# Altium project Main Board Block v1.2 Project.PrjPcb
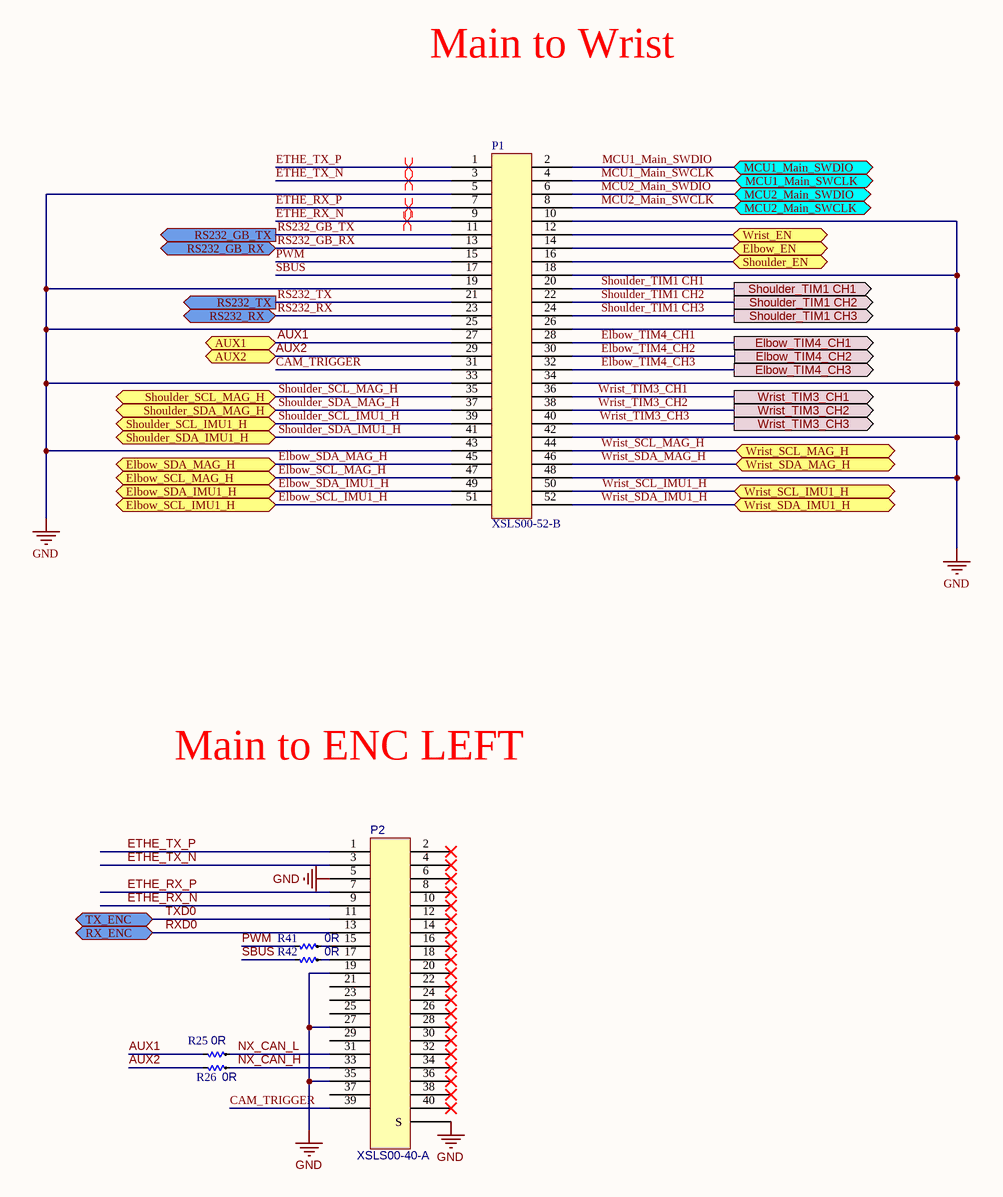
[diagram p0: Connector.SchDoc]
6 sheets, 158 parts. Net scope: flat (ports and power ports of the same name join across sheets).
Board file: Main_Block.PcbDoc
Sheets:
  Connector.SchDoc
  IMU.SchDoc
  PWR.SchDoc
  RS232.SchDoc
  MCU2.SchDoc
  MCU1.SchDoc

## Sheet Connector.SchDoc
size A3; SheetNumber: 1; SheetTotal: 6

### Parts
P1  XSLS00-52-B  [XSXL52]
P2  XSLS00-40-A  [XSXL40]
R25  value 0R  [RES0402]  (hidden comment: RES0402 0R)  (no BOM)
R26  value 0R  [RES0402]  (hidden comment: RES0402 0R)  (no BOM)
R41  value 0R  [RES0402]  (hidden comment: RES0402 0R)
R42  value 0R  [RES0402]  (hidden comment: RES0402 0R)

### Ports
AUX1 (bidir), AUX2 (bidir), Elbow_EN (bidir), Elbow_SCL_IMU1_H (bidir), Elbow_SCL_MAG_H (bidir), Elbow_SDA_IMU1_H (bidir), Elbow_SDA_MAG_H (bidir), Elbow_TIM4_CH1 (out), Elbow_TIM4_CH2 (out), Elbow_TIM4_CH3 (out), MCU1_Main_SWCLK (bidir), MCU1_Main_SWDIO (bidir), MCU2_Main_SWCLK (bidir), MCU2_Main_SWDIO (bidir), RS232_GB_RX (bidir), RS232_GB_TX (out), RS232_RX (bidir), RS232_TX (out), RX_ENC (bidir), Shoulder_EN (bidir), Shoulder_SCL_IMU1_H (bidir), Shoulder_SCL_MAG_H (bidir), Shoulder_SDA_IMU1_H (bidir), Shoulder_SDA_MAG_H (bidir), Shoulder_TIM1 CH1 (out), Shoulder_TIM1 CH2 (out), Shoulder_TIM1 CH3 (out), TX_ENC (bidir), Wrist_EN (bidir), Wrist_SCL_IMU1_H (bidir), Wrist_SCL_MAG_H (bidir), Wrist_SDA_IMU1_H (bidir), Wrist_SDA_MAG_H (bidir), Wrist_TIM3_CH1 (out), Wrist_TIM3_CH2 (out), Wrist_TIM3_CH3 (out)

### Nets
GND: P1.5 P1.10 P1.18 P1.19 P1.25 P1.26 P1.33 P1.34 P1.42 P1.43 P1.48 P2.0(S) P2.5 P2.19 P2.27 P2.35
AUX1: P1.27 R25.1 ; port AUX1
AUX2: P1.29 R26.1 ; port AUX2
CAM_TRIGGER: P1.31 P2.39
Elbow_SCL_IMU1_H: P1.51 ; port Elbow_SCL_IMU1_H
Elbow_SCL_MAG_H: P1.47 ; port Elbow_SCL_MAG_H
Elbow_SDA_IMU1_H: P1.49 ; port Elbow_SDA_IMU1_H
Elbow_SDA_MAG_H: P1.45 ; port Elbow_SDA_MAG_H
Elbow_TIM4_CH1: P1.28 ; port Elbow_TIM4_CH1
Elbow_TIM4_CH2: P1.30 ; port Elbow_TIM4_CH2
Elbow_TIM4_CH3: P1.32 ; port Elbow_TIM4_CH3
ETHE_RX_N: P1.9 P2.9
ETHE_RX_P: P1.7 P2.7
ETHE_TX_N: P1.3 P2.3
ETHE_TX_P: P1.1 P2.1
MCU1_Main_SWCLK: P1.4 ; port MCU1_Main_SWCLK
MCU1_Main_SWDIO: P1.2 ; port MCU1_Main_SWDIO
MCU2_Main_SWCLK: P1.8 ; port MCU2_Main_SWCLK
MCU2_Main_SWDIO: P1.6 ; port MCU2_Main_SWDIO
NX_CAN_H: P2.33 R26.2
NX_CAN_L: P2.31 R25.2
PWM: P1.15 R41.1
RS232_GB_RX: P1.13 ; port RS232_GB_RX
RS232_GB_TX: P1.11 ; port RS232_GB_TX
RS232_RX: P1.23 ; port RS232_RX
RS232_TX: P1.21 ; port RS232_TX
RXD0: P2.13 ; port RX_ENC
SBUS: P1.17 R42.1
Shoulder_SCL_IMU1_H: P1.39 ; port Shoulder_SCL_IMU1_H
Shoulder_SCL_MAG_H: P1.35 ; port Shoulder_SCL_MAG_H  [project net I2C1_SCL]
Shoulder_SDA_IMU1_H: P1.41 ; port Shoulder_SDA_IMU1_H
Shoulder_SDA_MAG_H: P1.37 ; port Shoulder_SDA_MAG_H  [project net I2C1_SDA]
Shoulder_TIM1 CH1: P1.20 ; port Shoulder_TIM1 CH1
Shoulder_TIM1 CH2: P1.22 ; port Shoulder_TIM1 CH2
Shoulder_TIM1 CH3: P1.24 ; port Shoulder_TIM1 CH3
TXD0: P2.11 ; port TX_ENC
Wrist_SCL_IMU1_H: P1.50 ; port Wrist_SCL_IMU1_H  [project net I2C3_SCL]
Wrist_SCL_MAG_H: P1.44 ; port Wrist_SCL_MAG_H
Wrist_SDA_IMU1_H: P1.52 ; port Wrist_SDA_IMU1_H  [project net I2C3_SDA]
Wrist_SDA_MAG_H: P1.46 ; port Wrist_SDA_MAG_H
Wrist_TIM3_CH1: P1.36 ; port Wrist_TIM3_CH1
Wrist_TIM3_CH2: P1.38 ; port Wrist_TIM3_CH2
Wrist_TIM3_CH3: P1.40 ; port Wrist_TIM3_CH3
NetP1_12: P1.12 ; port Wrist_EN
NetP1_14: P1.14 ; port Elbow_EN
NetP1_16: P1.16 ; port Shoulder_EN
NetP2_15: P2.15 R41.2
NetP2_17: P2.17 R42.2

Not connected (* = marked no-connect by the designer): P2 2* 4* 6* 8* 10* 12* 14* 16* 18* 20* 21 22* 23 24* 25 26* 28* 29 30* 32* 34* 36* 37 38* 40*

### Layout directives
differential pair: ETHE_RX_N, ETHE_RX_P, ETHE_TX_N, ETHE_TX_P

### Notes on the sheet
- Main to Wrist
- Main to ENC LEFT

### Library data of the parts
R25 R26 R41 R42 = RES0402 0R: RES 0R 0402; MP: RC0402JR-070RL; Power Rating: 63mW; Tolerance: 5%; Package: 0402
P2 = XSLS00-40-A: Manufacturer Part Number 1: XSLS00-40-A

## Sheet IMU.SchDoc
size A; SheetNumber: 2; SheetTotal: 6
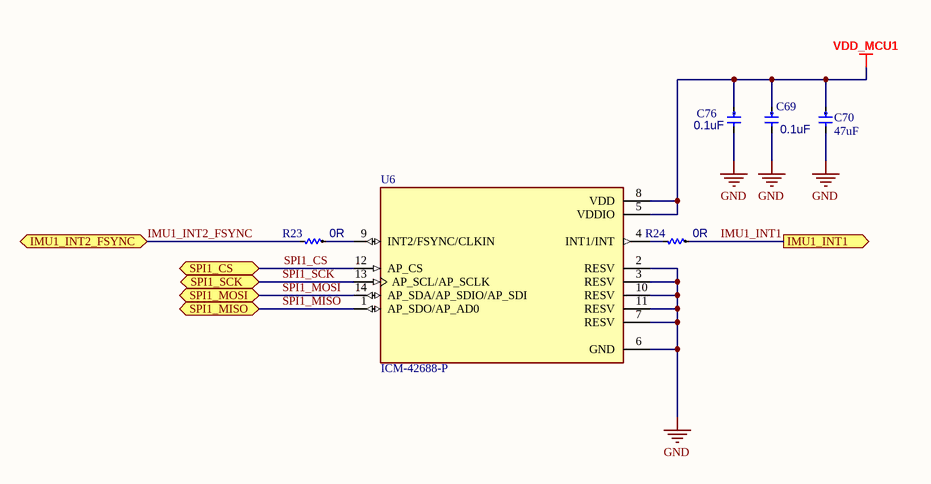
[diagram p1: IMU.SchDoc]

### Parts
C69  value 0.1uF  [CAP0402]  (hidden comment: CAP0402 0.1uF 50V)
C70  Capacitance: 47uF  [CAP0805]  (hidden comment: CL21A476MQYNNNE)
C76  value 0.1uF  [CAP0402]  (hidden comment: CAP0402 0.1uF 50V)
R23  value 0R  [RES0402]  (hidden comment: RES0402 0R)
R24  value 0R  [RES0402]  (hidden comment: RES0402 0R)
U6  ICM-42688-P  [IMU42688]

### Ports
IMU1_INT1 (out), IMU1_INT2_FSYNC (bidir), SPI1_CS (bidir), SPI1_MISO (bidir), SPI1_MOSI (bidir), SPI1_SCK (bidir)

### Nets
GND: C69.2 C70.2 C76.2 U6.2(RESV) U6.3(RESV) U6.6(GND) U6.7(RESV) U6.10(RESV) U6.11(RESV)
VDD_MCU1: C69.1 C70.1 C76.1 U6.5(VDDIO) U6.8(VDD)
IMU1_INT1: R24.2 ; port IMU1_INT1
IMU1_INT2_FSYNC: R23.1 ; port IMU1_INT2_FSYNC
SPI1_CS: U6.12(AP_CS) ; port SPI1_CS
SPI1_MISO: U6.1(AP_SDO/AP_AD0) ; port SPI1_MISO
SPI1_MOSI: U6.14(AP_SDA/AP_SDIO/AP_SDI) ; port SPI1_MOSI
SPI1_SCK: U6.13(AP_SCL/AP_SCLK) ; port SPI1_SCK
NetR23_2: R23.2 U6.9(INT2/FSYNC/CLKIN)
NetR24_1: R24.1 U6.4(INT1/INT)

### Library data of the parts
C69 C76 = CAP0402 0.1uF 50V: Cap 0.1uF 50V 0402; MP: CC0402KRX5R9BB104; Tolerance: 10%; Voltage: 50V; Package: 0402
C70 = 885012107014: CAP CER 47UF 6.3V X5R 0805; Tolerance: 20%; Manufacturer Part Number: CL21A476MQYNNNE; RoHS: Yes; Category: Ceramic Capacitors; Stock 1: 3580; Pricing 1: 1=0.37000, 5=0.35200, 10=0.33000, 25=0.31900, 50=0.30900, 100=0.29800 (USD); Mount: Surface Mount; Case/Package: 0805; Case Code (Metric): 2012; Case Code (Imperial): 0805; Min Operating Temperature: -55°C; Max Operating Temperature: 85°C; Packaging: Cut Tape; Voltage Rating: 6.3V; Dielectric: X5R; Voltage Rating (DC): 6.3V; Series: WCAP-CSGP; Length: 0.079inch; Width: 0.049inch; Thickness: 0.057inch; RoHS Compliant: Yes; ComponentLink1URL: http://www.farnell.com/datasheets/1958454.pdf?src-supplier=Farnell; ComponentLink1Description: http://www.farnell.com/datasheets/1958454.pdf?src-supplier=Farnell; ComponentLink2URL: http://www.farnell.com/datasheets/1958454.pdf?src-supplier=Element14; ComponentLink2Description: http://www.farnell.com/datasheets/1958454.pdf?src-supplier=Element14; ComponentLink3URL: https://katalog.we-online.de/pbs/datasheet/885012107014.pdf?src-supplier=Digi-Key; ComponentLink3Description: https://katalog.we-online.de/pbs/datasheet/885012107014.pdf?src-supplier=Digi-Key; ComponentLink4URL: http://www.farnell.com/datasheets/1958454.pdf?src-supplier=Newark; ComponentLink4Description: http://www.farnell.com/datasheets/1958454.pdf?src-supplier=Newark; Supplier 1: Newark
R23 R24 = RES0402 0R: as R25 on sheet Connector; Package: 0402
U6 = ICM-42688-P: Accelerometer, Gyroscope, 6 Axis Sensor Output; Package: None; MP: ICM-42688-P; Value: *; Availability: Unavailable; Price: None

## Sheet PWR.SchDoc
size A3; SheetNumber: 3; SheetTotal: 6
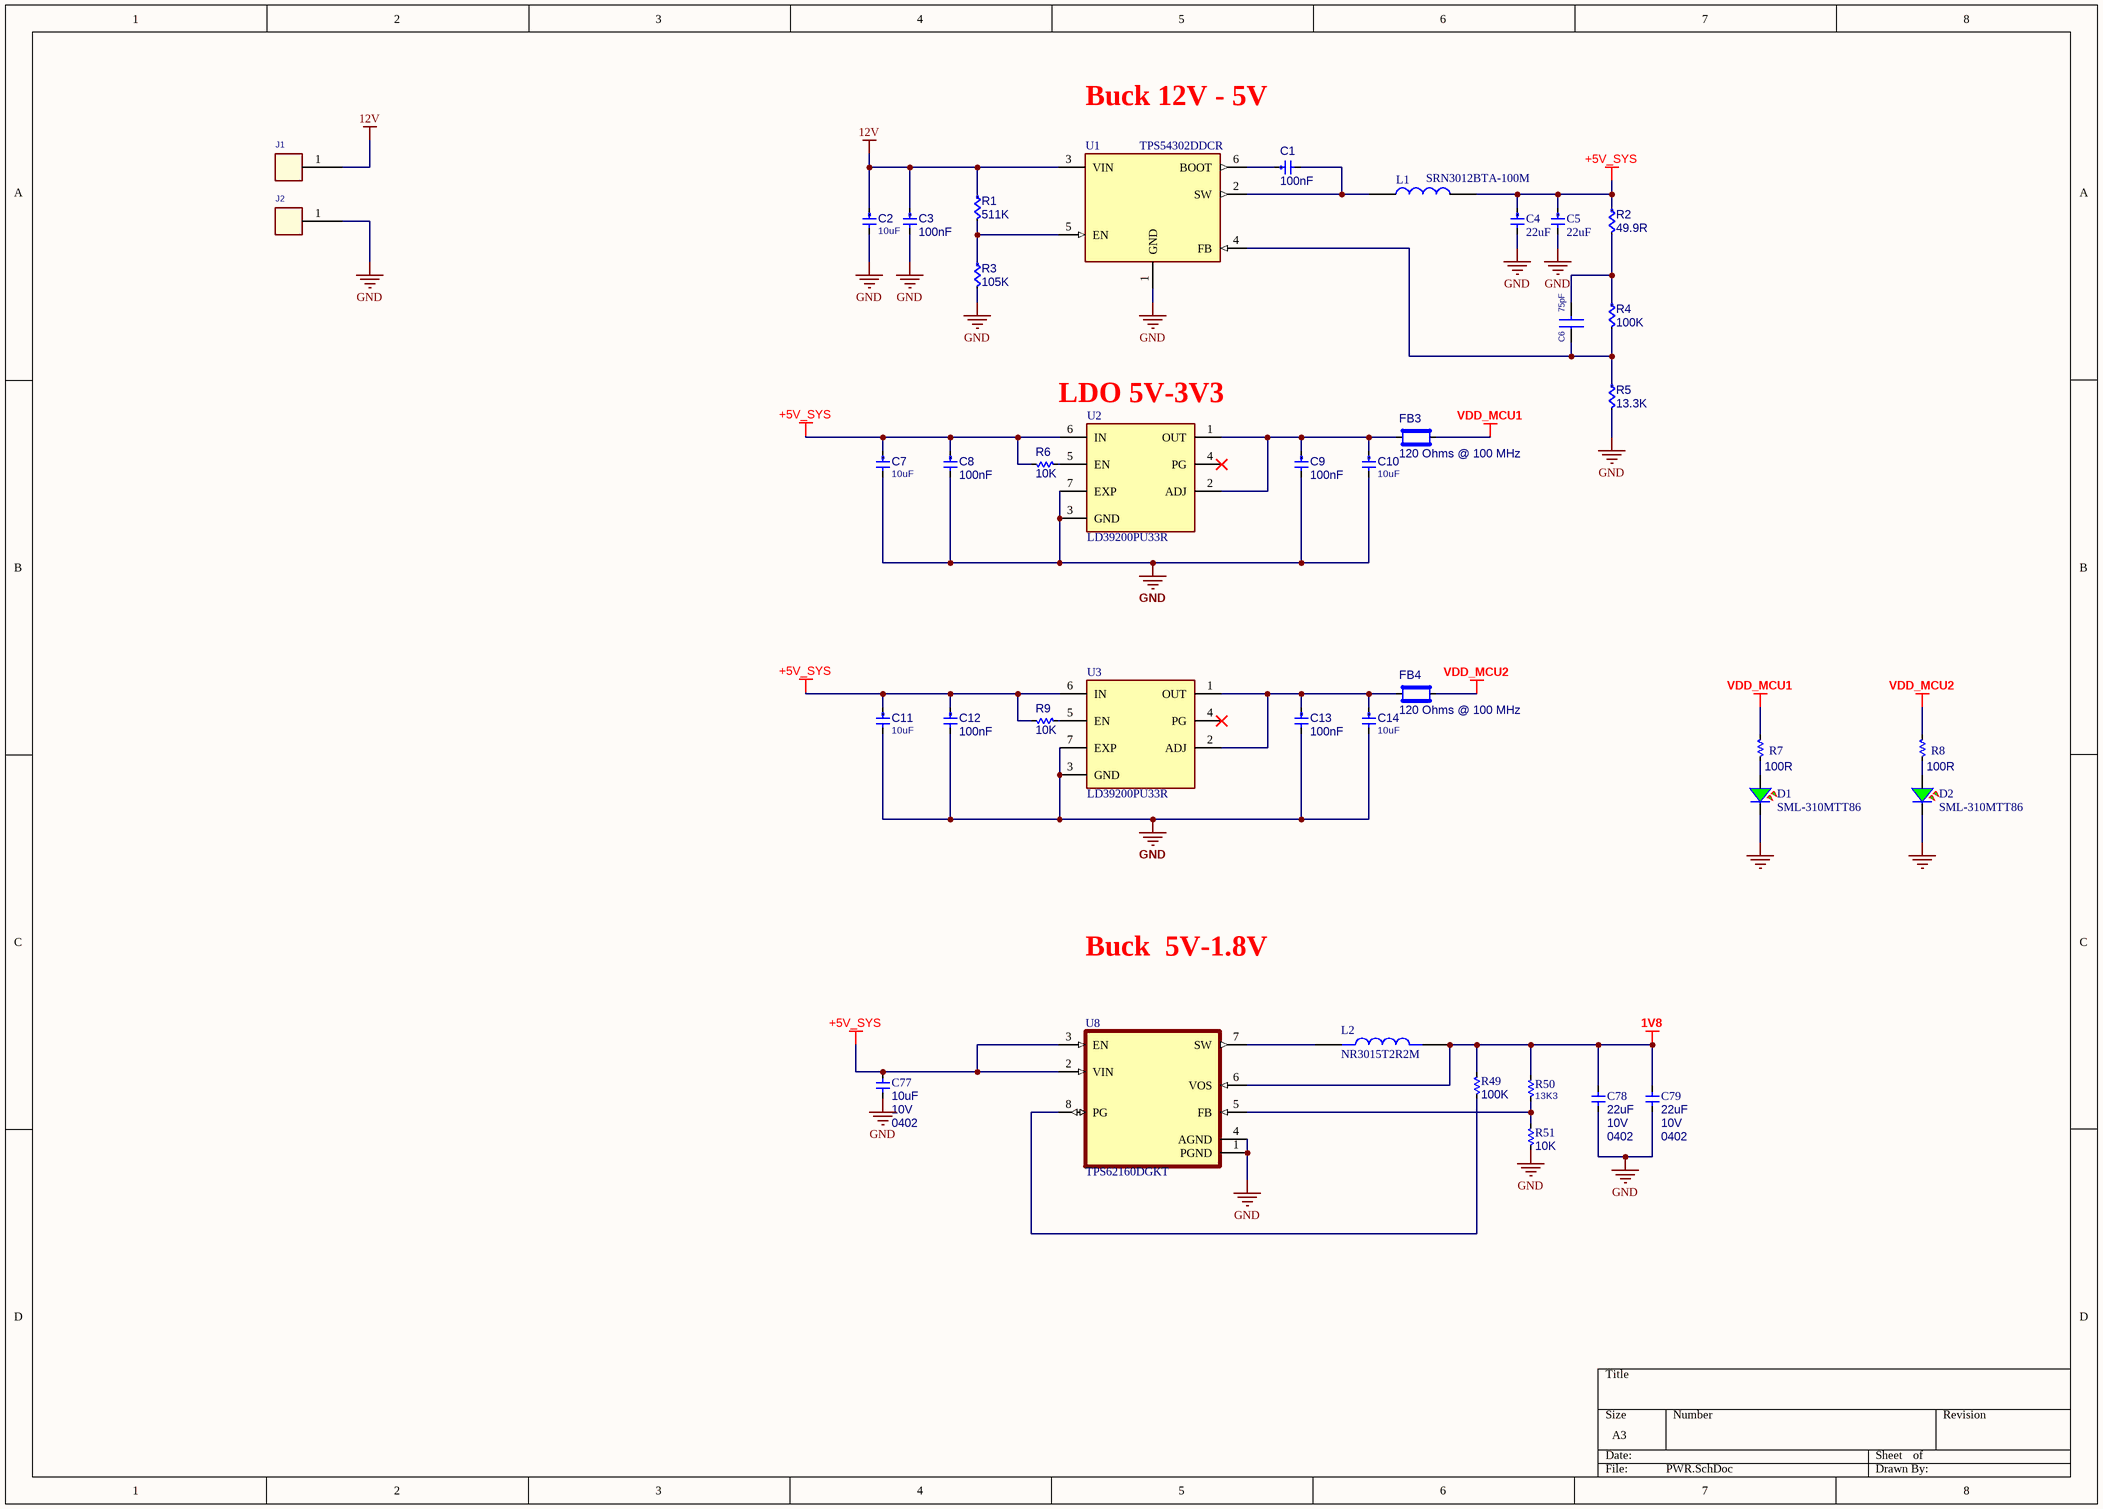
[diagram p2: PWR.SchDoc]

### Parts
C1  Capacitance: 100nF  [CAP0402]  (hidden comment: CC0402KRX5R9BB104)
C2  Capacitance: 10uF  [CAP0603-M]  (hidden comment: GRM188R6YA106MA73D)
C3  Capacitance: 100nF  [CAP0402]  (hidden comment: CC0402KRX5R9BB104)
C4  Capacitance: 22uF  [CAP0402]  (hidden comment: GRM158R61A226ME15D)
C5  Capacitance: 22uF  [CAP0402]  (hidden comment: GRM158R61A226ME15D)
C6  75pF  [CAP0402]
C7  Capacitance: 10uF  [CAP0603]  (hidden comment: GRM188R6YA106MA73D)
C8  Capacitance: 100nF  [CAP0402]  (hidden comment: CC0402KRX5R9BB104)
C9  Capacitance: 100nF  [CAP0402]  (hidden comment: CC0402KRX5R9BB104)
C10  Capacitance: 10uF  [CAP0603]  (hidden comment: GRM188R6YA106MA73D)
C11  Capacitance: 10uF  [CAP0603]  (hidden comment: GRM188R6YA106MA73D)
C12  Capacitance: 100nF  [CAP0402]  (hidden comment: CC0402KRX5R9BB104)
C13  Capacitance: 100nF  [CAP0402]  (hidden comment: CC0402KRX5R9BB104)
C14  Capacitance: 10uF  [CAP0603]  (hidden comment: GRM188R6YA106MA73D)
C77  value 10uF  Voltage: 10V  Package: 0402  [CAP0402]  (hidden comment: CAP0402 10uF 10V)
C78  value 22uF  Voltage: 10V  Package: 0402  [CAP0402]  (hidden comment: CAP0402 22uF 10V)
C79  value 22uF  Voltage: 10V  Package: 0402  [CAP0402]  (hidden comment: CAP0402 22uF 10V)
D1  SML-310MTT86  [LED0603 GREEN]
D2  SML-310MTT86  [LED0603 GREEN]
FB3  Impedance @ Frequency: 120 Ohms @ 100 MHz  [FERRIT0402]  (hidden comment: BLM15PX121SZ1D)
FB4  Impedance @ Frequency: 120 Ohms @ 100 MHz  [FERRIT0402]  (hidden comment: BLM15PX121SZ1D)
J1  CON1  [wire1_220s]  (value not drawn)
J2  CON1  [wire1_220s]  (value not drawn)
L1  SRN3012BTA-100M  [SRN3012BTA-100M]
L2  NR3015T2R2M  [IND_NR3015T2R2M]
R1  511K  [RES0402]
R2  49.9R  [RES0402]
R3  105K  [RES0402]
R4  100K  [RES0402]
R5  13.3K  [RES0402]
R6  value 10K  [RES0402]  (hidden comment: RES0402 10K)
R7  value 100R  [RES0402]  (hidden comment: RES0402 100R)
R8  value 100R  [RES0402]  (hidden comment: RES0402 100R)
R9  value 10K  [RES0402]  (hidden comment: RES0402 10K)
R49  value 100K  [RES0402]  (hidden comment: RES0402 100K)
R50  value 13K3  [RES0402]  (hidden comment: RES0402 13K3)
R51  value 10K  [RES0402]  (hidden comment: RES0402 10K)
U1  TPS54302DDCR  [SOT95P280X110-6N - duplicate1]
U2  LD39200PU33R  [LD39200PUR]
U3  LD39200PU33R  [LD39200PUR]
U8  TPS62160DGKT  [SOP65P490X110-8N]

### Nets
1V8: C78.2 C79.2 L2.2 R49.2 R50.2 U8.6(VOS)
12V: C2.1 C3.1 J1.1 R1.1 U1.3(VIN)
+5V_SYS: C4.1 C5.1 C7.1 C8.1 C11.1 C12.1 C77.2 L1.2 R2.1 R6.2 R9.2 U2.6(IN) U3.6(IN) U8.2(VIN) U8.3(EN)
GND: C2.2 C3.2 C4.2 C5.2 C7.2 C8.2 C9.2 C10.2 C11.2 C12.2 C13.2 C14.2 C77.1 C78.1 C79.1 D1.1 D2.1 J2.1 R3.2 R5.2 R51.1 U1.1(GND) U2.3(GND) U2.7(EXP) U3.3(GND) U3.7(EXP) U8.1(PGND) U8.4(AGND)
VDD_MCU1: FB3.2 R7.2
VDD_MCU2: FB4.2 R8.2
NetC1_1: C1.1 U1.6(BOOT)
NetC1_2: C1.2 L1.1 U1.2(SW)
NetC6_1: C6.1 R4.2 R5.1 U1.4(FB)
NetC6_2: C6.2 R2.2 R4.1
NetC9_1: C9.1 C10.1 FB3.1 U2.1(OUT) U2.2(ADJ)
NetC13_1: C13.1 C14.1 FB4.1 U3.1(OUT) U3.2(ADJ)
NetD1_2: D1.2 R7.1
NetD2_2: D2.2 R8.1
NetL2_1: L2.1 U8.7(SW)
NetR1_2: R1.2 R3.1 U1.5(EN)
NetR6_1: R6.1 U2.5(EN)
NetR9_1: R9.1 U3.5(EN)
NetR49_1: R49.1 U8.8(PG)
NetR50_1: R50.1 R51.2 U8.5(FB)

Not connected (* = marked no-connect by the designer): U2 4(PG)*; U3 4(PG)*

### Notes on the sheet
- Buck 12V - 5V
- (near U2) LDO 5V-3V3
- Buck  5V-1.8V

### Library data of the parts
C1 C3 C8 C9 C12 C13 = CMP-00265-1: CAP CER 0.1UF 50V X5R 0402; Manufacturer: Yageo; Tolerance: 10%; Voltage Rating: 50V; Dielectric: X5R; Width: 0.02inch; Thickness: 0.022inch; Packaging: Tape and Reel; Length: 0.039inch; Mount: Surface Mount; Case/Package: 0402; Min Operating Temperature: -55°C; Halogen Free: Halogen Free; Voltage Rating (DC): 50V; Manufacturer Part Number: CC0402KRX5R9BB104; Max Operating Temperature: 85°C; Lead Free: Lead Free; Manufacturer 1: Yageo; Manufacturer Part Number 1: CC0402KRX5R9BB104
C2 C7 C10 C11 C14 = CMP-01031-1: CAP CER 10UF 35V X5R 0603; Manufacturer 1: Murata Electronics; Tolerance: 20%; Case/Package: 0603; Depth: 0.8mm; Composition: Ceramic; Length: 1.6mm; Max Operating Temperature: 85°C; Lead Free: Lead Free; Thickness: 0.031inch; Number of Pins: 2; Weight: 0.000222oz; Min Operating Temperature: -55°C; REACH SVHC: No SVHC; Case Code (Metric): 1608; Termination: SMD/SMT; Packaging: Tape and Reel; Height: 0.8mm; Voltage Rating (DC): 35V; Width: 0.031inch; Voltage Rating: 35V; Manufacturer Part Number 1: GRM188R6YA106MA73D; Mount: Surface Mount; Package Quantity: 1; Case Code (Imperial): 0603; Dielectric: X5R; Voltage: 35V
C4 C5 = CMP-00520-1: CAP CER 22UF 10V X5R 0402; Manufacturer 1: TDK Corporation; Tolerance: 10%; Case Code (Imperial): 0402; Case/Package: 0402; Voltage: 10V; Min Operating Temperature: -55°C; Termination: SMD/SMT; Voltage Rating: 10V; Length: 1mm; REACH SVHC: No SVHC; Max Operating Temperature: 85°C; Radiation Hardening: No; Depth: 0.5mm; Case Code (Metric): 1005; Dielectric: X5R; Manufacturer Part Number 1: GRM158R61A226ME15D; Packaging: Tape and Reel
C6 = CAP_Dup1_16: CAP CER 75PF 25V C0G/NP0 0402; Manufacturer PN: CC0402JRNPO9BN750; Manufacturer: YAGEO; PART_NUMBER: TMP-416; CLASS: DISCRETE; Tolerance: 5%; Temperature Coefficient: C0G, NP0; Dielectric Type: Capacitors; Rated Voltage: 25V; Package Size: 0402 (1005 Metric)
C77 = CAP0402 10uF 10V: Cap 10uF 10V 0402; MP: GRT155R61A106ME13D
C78 C79 = CAP0402 22uF 10V: Cap 22uF 10V 0402; MP: GRM158R61A226ME15D
D1 D2 = CMP-01130-2: LED GREEN CLEAR 0603 SMD; Manufacturer 1: Rohm Semiconductor; Luminous Intensity: 16mcd; Wavelength: 570nm; Number of LEDs: 1; Color: Green,Yellow; Forward Voltage: 2.2V; Lens Color: Colorless,Clear; Forward Current: 20mA; Viewing Angle: 140°; Lens Style: Rectangular,Clear,Diffused,Colorless; Case Code (Imperial): 0603; Lens Transparency: Clear; Package Quantity: 3000; Width: 0.8mm; Manufacturer Part Number 1: SML-310MTT86; Min Operating Temperature: -30°C; Length: 1.6mm; Packaging: Tape and Reel; Dominant Wavelength: 570nm; Height: 0.9mm; Radiation Hardening: No; Test Current: 20mA; Case Code (Metric): 1608; Lead Free: Lead Free; Case/Package: 0603; Mount: Surface Mount; Max Operating Temperature: 85°C; Illumination Color: Green; Number of Pins: 2
FB3 FB4 = BLM15PX121SZ1D: 120 Ohms @ 100 MHz 1 Power Line Ferrite Bead 0402 (1005 Metric) 2A 55mOhm; MP: BLM15PX121SZ1D; Current Rating (Max): 2A; DC Resistance (DCR) (Max): 55mOhm
J1 J2 = CON1: SOLDER PADS
L1 = SRN3012BTA-330M: 10uH; Manufacturer_Name: Bourns; Geometry.Height: 1.2mm; Mouser Part Number: SRN3012BTA-100M; Mouser Price/Stock: https://www.mouser.co.uk/ProductDetail/Bourns/SRN3012BTA-330M?qs=Imq1NPwxi74rPoSZ4PPaRw%3D%3D; Manufacturer_Part_Number: SRN3012BTA-100M; Datasheet Link: https://www.bourns.com/docs/Product-Datasheets/SRN3012BTA.pdf
L2 = NR3015T2R2M: 2.2 ÂµH Shielded Drum Core, Wirewound Inductor 1.5 A 72mOhm Max Nonstandard; MF: Taiyo Yuden; MP: NR3015T2R2M; Price: None; Purchase-URL: https://pricing.snapeda.com/search/part/NR3015T2R2M/?ref=eda; Package: Nonstandard Taiyo Yuden; Check_prices: https://www.snapeda.com/parts/NR3015T2R2M/Taiyo+Yuden/view-part/?ref=eda; Value: *; Availability: In Stock; SnapEDA_Link: https://www.snapeda.com/parts/NR3015T2R2M/Taiyo+Yuden/view-part/?ref=snap
R1 = CMP-00299-1_1: RES SMD 511K OHM 1% 1/16W 0402; Manufacturer: Yageo; Manufacturer Part Number: RC0402FR-07511KL; Temperature Coefficient: 100ppm/°C; Working Voltage: 50V; Max Power Dissipation: 63mW; Power Rating: 62.5mW; Height: 0.016inch; Package Quantity: 1; Min Operating Temperature: -55°C; Tolerance: 1%; Military Standard: Not; Packaging: Tape and Reel; Number of Terminations: 2; Width: 0.02inch; Case/Package: 0402; Length: 1mm; Voltage Rating (DC): 50V; Case Code (Metric): 1005; Resistance: 511K; Composition: Thick Film; Voltage Rating: 50V; Max Operating Temperature: 155°C; Case Code (Imperial): 0402; Lead Free: Lead Free; Termination: SMD/SMT; Features: Moisture Resistant; Depth: 0.5mm; Manufacturer 1: Yageo; Manufacturer Part Number 1: RC0402FR-07511KL
R2 = CMP-00299-1_1: RES SMD 49.9R OHM 1% 1/16W 0402; Manufacturer: Yageo; Manufacturer Part Number: RC0402FR-0749R9L; Temperature Coefficient: 100ppm/°C; Working Voltage: 50V; Max Power Dissipation: 63mW; Power Rating: 62.5mW; Height: 0.016inch; Package Quantity: 1; Min Operating Temperature: -55°C; Tolerance: 1%; Military Standard: Not; Packaging: Tape and Reel; Number of Terminations: 2; Width: 0.02inch; Case/Package: 0402; Length: 1mm; Voltage Rating (DC): 50V; Case Code (Metric): 1005; Resistance: 49.9R; Composition: Thick Film; Voltage Rating: 50V; Max Operating Temperature: 155°C; Case Code (Imperial): 0402; Lead Free: Lead Free; Termination: SMD/SMT; Features: Moisture Resistant; Depth: 0.5mm; Manufacturer 1: Yageo; Manufacturer Part Number 1: RC0402FR-0749R9L
R3 = CMP-00299-1_1: RES SMD 105K OHM 1% 1/16W 0402; Manufacturer: Yageo; Manufacturer Part Number: RC0402FR-07105KL; Temperature Coefficient: 100ppm/°C; Working Voltage: 50V; Max Power Dissipation: 63mW; Power Rating: 62.5mW; Height: 0.016inch; Package Quantity: 1; Min Operating Temperature: -55°C; Tolerance: 1%; Military Standard: Not; Packaging: Tape and Reel; Number of Terminations: 2; Width: 0.02inch; Case/Package: 0402; Length: 1mm; Voltage Rating (DC): 50V; Case Code (Metric): 1005; Resistance: 105K; Composition: Thick Film; Voltage Rating: 50V; Max Operating Temperature: 155°C; Case Code (Imperial): 0402; Lead Free: Lead Free; Termination: SMD/SMT; Features: Moisture Resistant; Depth: 0.5mm; Manufacturer 1: Yageo; Manufacturer Part Number 1: RC0402FR-07105KL
R4 = CMP-00299-1_1: RES SMD 100K OHM 1% 1/16W 0402; Manufacturer: Yageo; Manufacturer Part Number: RC0402FR-07100KL; Temperature Coefficient: 100ppm/°C; Working Voltage: 50V; Max Power Dissipation: 63mW; Power Rating: 62.5mW; Height: 0.016inch; Package Quantity: 1; Min Operating Temperature: -55°C; Tolerance: 1%; Military Standard: Not; Packaging: Tape and Reel; Number of Terminations: 2; Width: 0.02inch; Case/Package: 0402; Length: 1mm; Voltage Rating (DC): 50V; Case Code (Metric): 1005; Resistance: 100K; Composition: Thick Film; Voltage Rating: 50V; Max Operating Temperature: 155°C; Case Code (Imperial): 0402; Lead Free: Lead Free; Termination: SMD/SMT; Features: Moisture Resistant; Depth: 0.5mm; Manufacturer 1: Yageo; Manufacturer Part Number 1: RC0402FR-07100KL
R5 = CMP-00299-1_1: RES SMD 13.3K OHM 1% 1/16W 0402; Manufacturer: Yageo; Manufacturer Part Number: RC0402FR-0713K3L; Temperature Coefficient: 100ppm/°C; Working Voltage: 50V; Max Power Dissipation: 63mW; Power Rating: 62.5mW; Height: 0.016inch; Package Quantity: 1; Min Operating Temperature: -55°C; Tolerance: 1%; Military Standard: Not; Packaging: Tape and Reel; Number of Terminations: 2; Width: 0.02inch; Case/Package: 0402; Length: 1mm; Voltage Rating (DC): 50V; Case Code (Metric): 1005; Resistance: 13.3K; Composition: Thick Film; Voltage Rating: 50V; Max Operating Temperature: 155°C; Case Code (Imperial): 0402; Lead Free: Lead Free; Termination: SMD/SMT; Features: Moisture Resistant; Depth: 0.5mm; Manufacturer 1: Yageo; Manufacturer Part Number 1: RC0402FR-0713K3L
R6 R9 R51 = RES0402 10K: RES 10K 0402; MP: RC0402FR-0710KL
R7 R8 = RES0402 100R: RES 100R 0402; MP: RC0402FR-07100RL
R49 = RES0402 100K: RES 100K 0402; MP: RC0402FR-07100KL
R50 = RES0402 13K3: RES 13K3 0402; MP: RC0402FR-0713K3L
U1 = TPS54302DDCR: 4.5-V to 28-V Input, 3-A Output, EMI Friendly Synchronous Step-Down Converter; MF: Texas Instruments; Package: SOT-23-THN-6 Texas Instruments; Price: None; Check_prices: https://www.snapeda.com/parts/TPS54302DDCR/Texas+Instruments/view-part/?ref=eda; Value: *; SnapEDA_Link: https://www.snapeda.com/parts/TPS54302DDCR/Texas+Instruments/view-part/?ref=snap; MP: TPS54302DDCR; Availability: In Stock; Purchase-URL: https://pricing.snapeda.com/search?q=TPS54302DDCR&ref=eda
U2 U3 = LD39200PUR: LDO IC 1 Output 2A 6-DFN _3x3_; MF: STMicroelectronics; Package: DFN-6 STMicroelectronics; Availability: Unavailable; MP: LD39200PU33R; Value: *; SnapEDA_Link: https://www.snapeda.com/parts/LD39200PUR/STMicroelectronics/view-part/882017/?ref=snap; Price: None
U8 = TPS62160DGKT: 3V-17V 1A Step-Down Converters with DCS-Controlâ„¢; MF: Texas Instruments; SnapEDA_Link: https://www.snapeda.com/parts/TPS62160DGKT/Texas+Instruments/view-part/?ref=snap; Package: VSSOP-8 Texas Instruments; Value: *; MP: TPS62160DGKT; Check_prices: https://www.snapeda.com/parts/TPS62160DGKT/Texas+Instruments/view-part/?ref=eda

## Sheet RS232.SchDoc
size A; SheetNumber: 4; SheetTotal: 6
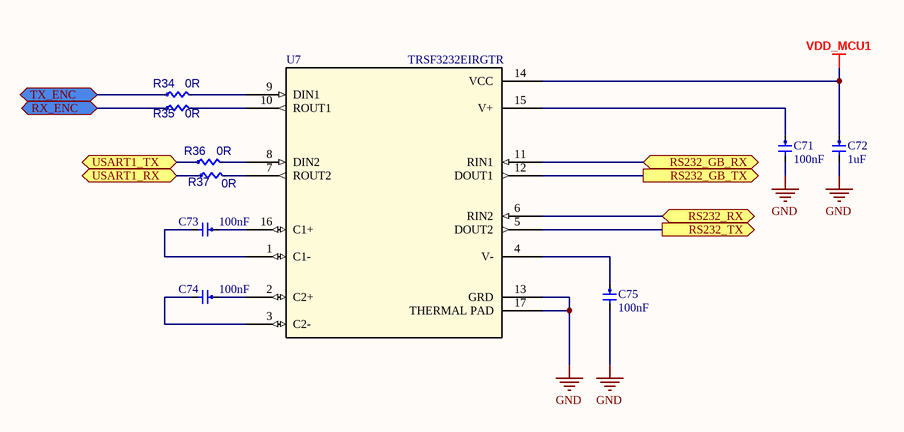
[diagram p3: RS232.SchDoc]

### Parts
C71  Capacitance: 100nF  [CAP0402]  (hidden comment: GRM155R71H104KE14D)
C72  Capacitance: 1uF  [CAP0402]  (hidden comment: CC0402KRX5R8BB105)
C73  Capacitance: 100nF  [CAP0402]  (hidden comment: GRM155R71H104KE14D)
C74  Capacitance: 100nF  [CAP0402]  (hidden comment: GRM155R71H104KE14D)
C75  Capacitance: 100nF  [CAP0402]  (hidden comment: GRM155R71H104KE14D)
R34  Resistance: 0R  [RES0402]  (hidden comment: ERJ-2RKF4701X)
R35  Resistance: 0R  [RES0402]  (hidden comment: ERJ-2RKF4701X)
R36  Resistance: 0R  [RES0402]  (hidden comment: ERJ-2RKF4701X)
R37  Resistance: 0R  [RES0402]  (hidden comment: ERJ-2RKF4701X)
U7  TRSF3232EIRGTR  [TRSF3232EIRGTR]

### Ports
RS232_GB_RX (bidir), RS232_GB_TX (out), RS232_RX (bidir), RS232_TX (out), RX_ENC (bidir), TX_ENC (bidir), USART1_RX (bidir), USART1_TX (bidir)

### Nets
GND: C71.2 C72.2 C75.2 U7.13(GRD) U7.17(THERMAL_PAD)
VDD_MCU1: C72.1 U7.14(VCC)
RS232_GB_RX: U7.11(RIN1) ; port RS232_GB_RX
RS232_GB_TX: U7.12(DOUT1) ; port RS232_GB_TX
RS232_RX: U7.6(RIN2) ; port RS232_RX
RS232_TX: U7.5(DOUT2) ; port RS232_TX
RXD0: R35.1 ; port RX_ENC
TXD0: R34.1 ; port TX_ENC
USART1_RX: R37.1 ; port USART1_RX
USART1_TX: R36.1 ; port USART1_TX
NetC71_1: C71.1 U7.15(V+)
NetC73_1: C73.1 U7.16(C1+)
NetC73_2: C73.2 U7.1(C1-)
NetC74_1: C74.1 U7.2(C2+)
NetC74_2: C74.2 U7.3(C2-)
NetC75_1: C75.1 U7.4(V-)
NetR34_2: R34.2 U7.9(DIN1)
NetR35_2: R35.2 U7.10(ROUT1)
NetR36_2: R36.2 U7.8(DIN2)
NetR37_2: R37.2 U7.7(ROUT2)

### Library data of the parts
C71 C73-C75 = CMP-01036-1: CAP CER 0.1UF 50V X7R 0402; Manufacturer 1: Murata Electronics; Dielectric Material: Ceramic; Tolerance: 10%; Dissipation Factor: 0.025%; Termination: SMD/SMT; Voltage Rating: 50V; Composition: Ceramic; Max Operating Temperature: 125°C; REACH SVHC: No SVHC; Case/Package: 0402; Case Code (Imperial): 0402; Material: Ceramic; Manufacturer Part Number 1: GRM155R71H104KE14D; Weight: 0.000212oz; Width: 0.5mm; Package Quantity: 10000; Packaging: Tape and Reel; Mount: Surface Mount; Voltage Rating (DC): 50V; Dielectric: X7R; Depth: 0.5mm; Case Code (Metric): 1005; Length: 1mm; Height: 0.5mm; Min Operating Temperature: -55°C; Thickness: 0.022inch; Lead Free: Lead Free; Voltage: 50V
C72 = CMP-00520-1: CAP CER 1UF 25V X5R 0402; Manufacturer 1: TDK Corporation; Tolerance: 10%; Case Code (Imperial): 0402; Case/Package: 0402; Voltage: 25V; Min Operating Temperature: -55°C; Termination: SMD/SMT; Voltage Rating: 25V; Length: 1mm; REACH SVHC: No SVHC; Max Operating Temperature: 85°C; Radiation Hardening: No; Depth: 0.5mm; Case Code (Metric): 1005; Dielectric: X5R; Manufacturer Part Number 1: CC0402KRX5R8BB105; Packaging: Tape and Reel
R34-R37 = CMP-00607-1: RES SMD 4.7K OHM 1% 1/10W 0402; Manufacturer 1: Panasonic Electronic Components; Voltage Rating (DC): 50V; Power Rating: 100mW; Temperature Coefficient: 100ppm/°C; Depth: 0.5mm; Packaging: Tape and Reel; Width: 0.02inch; Case/Package: 0402; Tolerance: 1%; Composition: Thick Film; Case Code (Metric): 1005; Military Standard: Not; Voltage Rating: 50V; Manufacturer Part Number 1: ERJ-2RKF4701X; Number of Pins: 2; Package Quantity: 1; Case Code (Imperial): 0402; Lead Free: Lead Free; Height: 0.35mm; Radiation Hardening: No; Mount: Surface Mount; REACH SVHC: No SVHC; Number of Terminations: 2; Features: Automotive AEC-Q200; Length: 1mm; Min Operating Temperature: -55°C; Max Operating Temperature: 155°C; Max Power Dissipation: 100mW; Contact Plating: Tin; Termination: SMD/SMT
U7 = TRSF3232EIRGTR: No Description Available; Mfr_Name: Texas Instruments; RefDes: RefDes; Type: Type

## Sheet MCU2.SchDoc
size A3; SheetNumber: 5; SheetTotal: 6
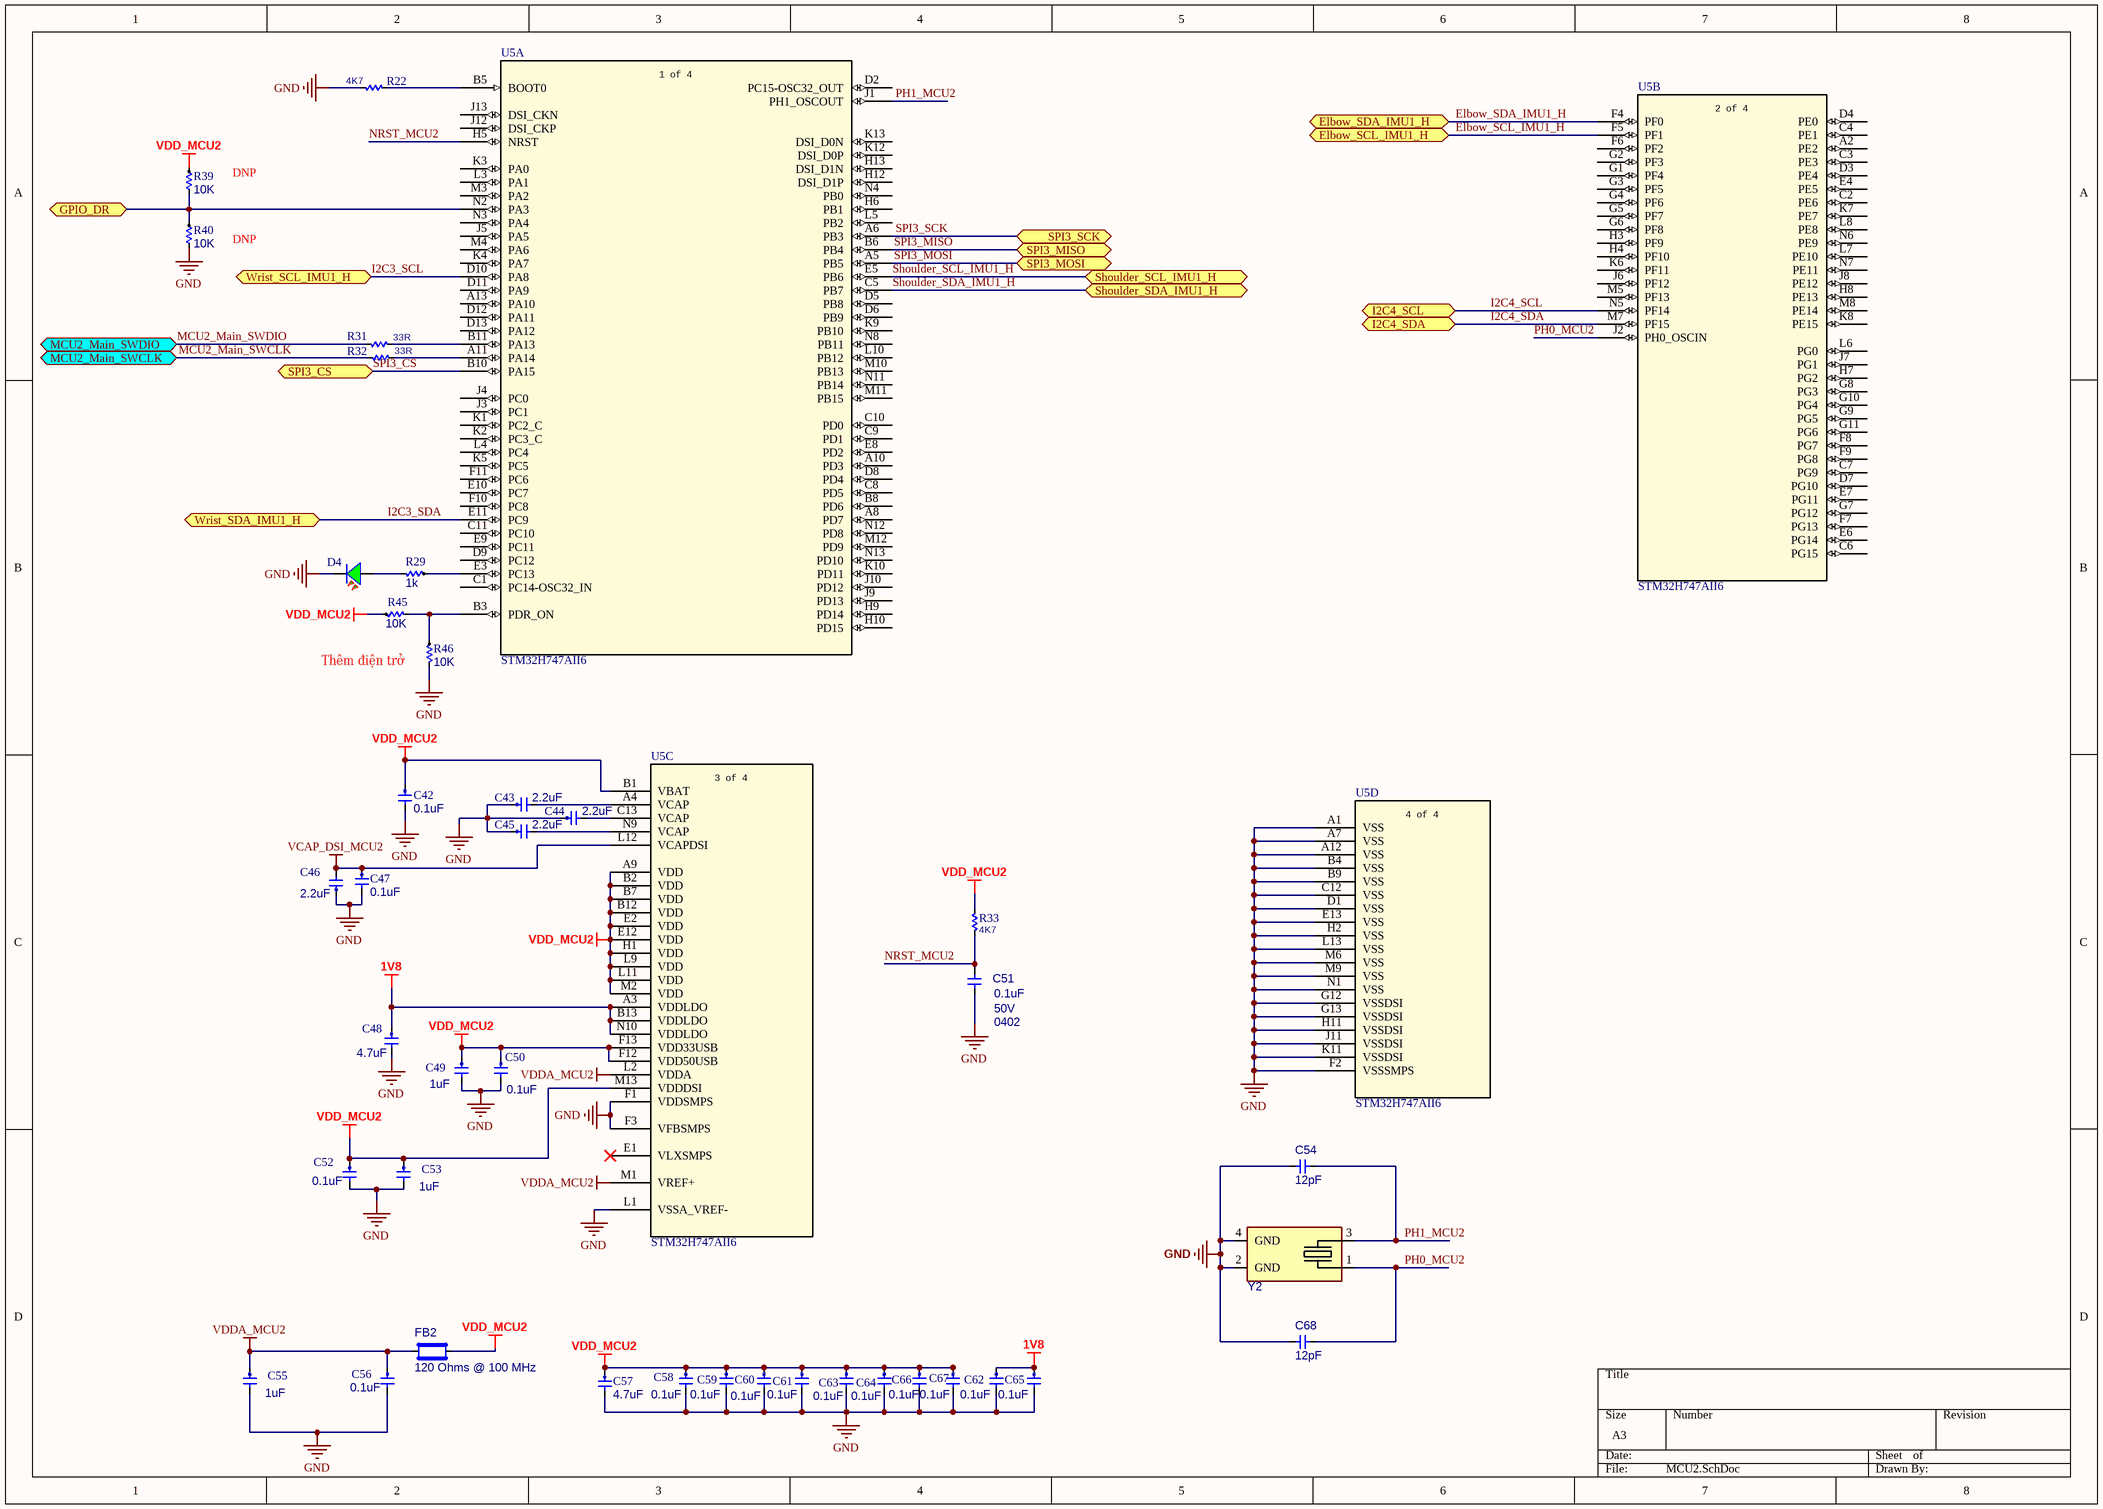
[diagram p4: MCU2.SchDoc]

### Parts
C42  value 0.1uF  [CAP0402]  (hidden comment: CAP0402 0.1uF 50V)
C43  value 2.2uF  [CAP0402]  (hidden comment: CAP0402 2.2uF 16V)
C44  value 2.2uF  [CAP0402]  (hidden comment: CAP0402 2.2uF 16V)
C45  value 2.2uF  [CAP0402]  (hidden comment: CAP0402 2.2uF 16V)
C46  value 2.2uF  [CAP0402]  (hidden comment: CAP0402 2.2uF 16V)
C47  value 0.1uF  [CAP0402]  (hidden comment: CAP0402 0.1uF 50V)
C48  value 4.7uF  [CAP0402]  (hidden comment: CAP0402 4.7uF 25V)
C49  value 1uF  [CAP0402]  (hidden comment: CAP0402 1uF 50V)
C50  value 0.1uF  [CAP0402]  (hidden comment: CAP0402 0.1uF 50V)
C51  value 0.1uF  Voltage: 50V  Package: 0402  [CAP0402]  (hidden comment: CAP0402 0.1uF 50V)
C52  value 0.1uF  [CAP0402]  (hidden comment: CAP0402 0.1uF 50V)
C53  value 1uF  [CAP0402]  (hidden comment: CAP0402 1uF 50V)
C54  value 12pF  [CAP0402]  (hidden comment: CAP0402 12pF 50V)
C55  value 1uF  [CAP0402]  (hidden comment: CAP0402 1uF 50V)
C56  value 0.1uF  [CAP0402]  (hidden comment: CAP0402 0.1uF 50V)
C57  value 4.7uF  [CAP0402]  (hidden comment: CAP0402 4.7uF 25V)
C58  value 0.1uF  [CAP0402]  (hidden comment: CAP0402 0.1uF 50V)
C59  value 0.1uF  [CAP0402]  (hidden comment: CAP0402 0.1uF 50V)
C60  value 0.1uF  [CAP0402]  (hidden comment: CAP0402 0.1uF 50V)
C61  value 0.1uF  [CAP0402]  (hidden comment: CAP0402 0.1uF 50V)
C62  value 0.1uF  [CAP0402]  (hidden comment: CAP0402 0.1uF 50V)
C63  value 0.1uF  [CAP0402]  (hidden comment: CAP0402 0.1uF 50V)
C64  value 0.1uF  [CAP0402]  (hidden comment: CAP0402 0.1uF 50V)
C65  value 0.1uF  [CAP0402]  (hidden comment: CAP0402 0.1uF 50V)
C66  value 0.1uF  [CAP0402]  (hidden comment: CAP0402 0.1uF 50V)
C67  value 0.1uF  [CAP0402]  (hidden comment: CAP0402 0.1uF 50V)
C68  value 12pF  [CAP0402]  (hidden comment: CAP0402 12pF 50V)
D4  SML-310MTT86  [LED0603 GREEN]  (value not drawn)
FB2  Impedance @ Frequency: 120 Ohms @ 100 MHz  [FERRIT0402]  (hidden comment: BLM15PX121SZ1D)
R22  value 4K7  [RES0402]  (hidden comment: RES0402 4K7)
R29  value 1k  [RES0402]  (hidden comment: RES0402 1K)
R31  value 33R  [RES0402]  (hidden comment: RES0402 33R)
R32  value 33R  [RES0402]  (hidden comment: RES0402 33R)
R33  value 4K7  [RES0402]  (hidden comment: RES0402 4K7)
R39  value 10K  [RES0402]  (hidden comment: RES0402 10K)
R40  value 10K  [RES0402]  (hidden comment: RES0402 10K)
R45  value 10K  [RES0402]  (hidden comment: RES0402 10K)
R46  value 10K  [RES0402]  (hidden comment: RES0402 10K)
U5  STM32H747AII6  [UFBGA169]  (parts A,B,C,D of 4)
Y2  ECS-240-12-37B-CKY-TR  [XTAL_ECS-240-12-37B-CKY-TR]  (value not drawn)

### Ports
Elbow_SCL_IMU1_H (bidir), Elbow_SDA_IMU1_H (bidir), GPIO_DR (bidir), I2C4_SCL (bidir), I2C4_SDA (bidir), MCU2_Main_SWCLK (bidir), MCU2_Main_SWDIO (bidir), Shoulder_SCL_IMU1_H (bidir), Shoulder_SDA_IMU1_H (bidir), SPI3_CS (bidir), SPI3_MISO (bidir), SPI3_MOSI (bidir), SPI3_SCK (bidir), Wrist_SCL_IMU1_H (bidir), Wrist_SDA_IMU1_H (bidir)

### Nets
1V8: C48.1 C62.1 C65.1 U5.A3(VDDLDO) U5.B13(VDDLDO) U5.N10(VDDLDO)
GND: C42.2 C43.1 C44.1 C45.1 C46.1 C47.2 C48.2 C49.2 C50.2 C51.1 C52.2 C53.2 C54.2 C55.2 C56.2 C57.2 C58.2 C59.2 C60.2 C61.2 C62.2 C63.2 C64.2 C65.2 C66.2 C67.2 C68.2 D4.1 R22.1 R40.1 R46.1 U5.A1(VSS) U5.A7(VSS) U5.A12(VSS) U5.B4(VSS) U5.B9(VSS) U5.C12(VSS) U5.D1(VSS) U5.E13(VSS) U5.F1(VDDSMPS) U5.F2(VSSSMPS) U5.F3(VFBSMPS) U5.G12(VSSDSI) U5.G13(VSSDSI) U5.H2(VSS) U5.H11(VSSDSI) U5.J11(VSSDSI) U5.K11(VSSDSI) U5.L1(VSSA_VREF-) U5.L13(VSS) U5.M6(VSS) U5.M9(VSS) U5.N1(VSS) Y2.2(GND) Y2.4(GND)
VCAP_DSI_MCU2: C46.2 C47.1 U5.L12(VCAPDSI)
VDD_MCU2: C42.1 C49.1 C50.1 C52.1 C53.1 C57.1 C58.1 C59.1 C60.1 C61.1 C63.1 C64.1 C66.1 C67.1 FB2.2 R33.2 R39.2 R45.2 U5.A9(VDD) U5.B1(VBAT) U5.B2(VDD) U5.B7(VDD) U5.B12(VDD) U5.E2(VDD) U5.E12(VDD) U5.F12(VDD50USB) U5.F13(VDD33USB) U5.H1(VDD) U5.L9(VDD) U5.L11(VDD) U5.M2(VDD) U5.M13(VDDDSI)
VDDA_MCU2: C55.1 C56.1 FB2.1 U5.L2(VDDA) U5.M1(VREF+)
Elbow_SCL_IMU1_H: U5.F5(PF1) ; port Elbow_SCL_IMU1_H
Elbow_SDA_IMU1_H: U5.F4(PF0) ; port Elbow_SDA_IMU1_H
GPIO_DR: R39.1 R40.2 U5.N2(PA3) ; port GPIO_DR
I2C3_SCL: U5.D10(PA8) ; port Wrist_SCL_IMU1_H
I2C3_SDA: U5.E11(PC9) ; port Wrist_SDA_IMU1_H
I2C4_SCL: U5.N5(PF14) ; port I2C4_SCL
I2C4_SDA: U5.M7(PF15) ; port I2C4_SDA
MCU2_Main_SWCLK: R32.1 ; port MCU2_Main_SWCLK
MCU2_Main_SWDIO: R31.1 ; port MCU2_Main_SWDIO
NRST_MCU2: C51.2 R33.1 U5.H5(NRST)
PH0_MCU2: C68.1 U5.J2(PH0_OSCIN) Y2.1(IO)
PH1_MCU2: C54.1 U5.J1(PH1_OSCOUT) Y2.3(IO)
Shoulder_SCL_IMU1_H: U5.E5(PB6) ; port Shoulder_SCL_IMU1_H
Shoulder_SDA_IMU1_H: U5.C5(PB7) ; port Shoulder_SDA_IMU1_H
SPI3_CS: U5.B10(PA15) ; port SPI3_CS
SPI3_MISO: U5.B6(PB4) ; port SPI3_MISO
SPI3_MOSI: U5.A5(PB5) ; port SPI3_MOSI
SPI3_SCK: U5.A6(PB3) ; port SPI3_SCK
NetC43_2: C43.2 U5.A4(VCAP)
NetC44_2: C44.2 U5.C13(VCAP)
NetC45_2: C45.2 U5.N9(VCAP)
NetD4_2: D4.2 R29.1
NetR22_2: R22.2 U5.B5(BOOT0)
NetR29_2: R29.2 U5.E3(PC13)
NetR31_2: R31.2 U5.B11(PA13)
NetR32_2: R32.2 U5.A11(PA14)
NetR45_1: R45.1 R46.2 U5.B3(PDR_ON)

Not connected (* = marked no-connect by the designer): U5 A2(PE2) A8(PD7) A10(PD3) A13(PA10) B8(PD6) C1(PC14-OSC32_IN) C2(PE6) C3(PE3) C4(PE1) C6(PG15) C7(PG9) C8(PD5) C9(PD1) C10(PD0) C11(PC10) D2(PC15-OSC32_OUT) D3(PE4) D4(PE0) D5(PB8) D6(PB9) D7(PG10) D8(PD4) D9(PC12) D11(PA9) D12(PA11) D13(PA12) E1(VLXSMPS)* E4(PE5) E6(PG14) E7(PG11) E8(PD2) E9(PC11) E10(PC7) F6(PF2) F7(PG13) F8(PG7) F9(PG8) F10(PC8) F11(PC6) G1(PF4) G2(PF3) G3(PF5) G4(PF6) G5(PF7) G6(PF8) G7(PG12) G8(PG3) G9(PG5) G10(PG4) G11(PG6) H3(PF9) H4(PF10) H6(PB1) H7(PG2) H8(PE13) H9(PD14) H10(PD15) H12(DSI_D1P) H13(DSI_D1N) J3(PC1) J4(PC0) J5(PA5) J6(PF12) J7(PG1) J8(PE12) J9(PD13) J10(PD12) J12(DSI_CKP) J13(DSI_CKN) K1(PC2_C) K2(PC3_C) K3(PA0) K4(PA7) K5(PC5) K6(PF11) K7(PE7) K8(PE15) K9(PB10) K10(PD11) K12(DSI_D0P) K13(DSI_D0N) L3(PA1) L4(PC4) L5(PB2) L6(PG0) L7(PE10) L8(PE8) L10(PB12) M3(PA2) M4(PA6) M5(PF13) M8(PE14) M10(PB13) M11(PB15) M12(PD9) N3(PA4) N4(PB0) N6(PE9) N7(PE11) N8(PB11) N11(PB14) N12(PD8) N13(PD10)

### Notes on the sheet
- DNP
- (near R46) Thêm điện trở
- (in symbol STM32H747AII6, part A) 1 of 4
- (in symbol STM32H747AII6, part B) 2 of 4
- (in symbol STM32H747AII6, part C) 3 of 4
- (in symbol STM32H747AII6, part D) 4 of 4

### Library data of the parts
C42 C47 C50 C52 C56 C58-C67 = CAP0402 0.1uF 50V: as C69 on sheet IMU; Voltage: 50V; Package: 0402
C43-C46 = CAP0402 2.2uF 16V: Cap 2.2uF 16V 0402; MP: C1005X5R1C225K050BC; Voltage: 16V; Package: 0402
C48 C57 = CAP0402 4.7uF 25V: Cap 4.7uF 25V 0402; MP: GRM155C61E475ME15J; Tolerance: 20%; Voltage: 25V; Package: 0402
C49 C53 C55 = CAP0402 1uF 50V: Cap 1uF 50V 0402; MP: GRM155R61H105KE05D; Voltage - Rate: 50V; Package: 0402
C51 = CAP0402 0.1uF 50V: Cap 0.1uF 50V 0402; MP: CC0402KRX5R9BB104
C54 C68 = CAP0402 12pF 50V: Cap 12pF 50V 0402
D4 = CMP-01130-2: as D1 on sheet PWR; Case Code (Imperial): 0603; Lens Transparency: Clear; Package Quantity: 3000; Width: 0.8mm; Manufacturer Part Number 1: SML-310MTT86; Min Operating Temperature: -30°C; Length: 1.6mm; Packaging: Tape and Reel; Dominant Wavelength: 570nm; Height: 0.9mm; Radiation Hardening: No; Test Current: 20mA; Case Code (Metric): 1608; Lead Free: Lead Free; Case/Package: 0603; Mount: Surface Mount; Max Operating Temperature: 85°C; Illumination Color: Green; Number of Pins: 2
FB2 = BLM15PX121SZ1D: as FB3 on sheet PWR; MP: BLM15PX121SZ1D; Current Rating (Max): 2A; DC Resistance (DCR) (Max): 55mOhm
R22 R33 = RES0402 4K7: RES 4K7 0402; MP: RC0402JR-074K7L
R29 = RES0402 1K: RES 1K 0402; MP: RC0402FR-071KL; Tolerance: 1%; Power rating: 63mW; Package: 0402
R31 R32 = RES0402 33R: RES 33R 0402; MP: RC0402FR-0733RL
R39 R40 R45 R46 = RES0402 10K: RES 10K 0402; MP: RC0402FR-0710KL; Power rating: 63mW; Tolerance: 1%; Package: 0402
U5 = STM32H747AII6: High-performance and DSP with DP-FPU, Arm Cortex-M7 + Cortex-M4 MCU with 2MBytes of Flash memory, 1MB RAM, 480 MHz CPU, Art Accelerator, L1 cache, external memory interface, large set of peripherals, SMPS, MIPI-DSI; Manufacturer_Name: STMicroelectronics; Copyright: Copyright (C) 2026 Ultra Librarian. All rights reserved.; Manufacturer_Part_Number: STM32H747AII6; RefDes: RefDes; Type: Type
Y2 = ECS-240-12-37B-CKY-TR: Crystal 24 MHz ±10ppm 12pF 50 Ohms 4-SMD, No Lead; Frequency: 24 MHz; ESR (Equivalent Series Resistance): 50 Ohms; MP: ECS-240-12-37B-CKY-TR; Frequency Stability: ±10ppm; Frequency Tolerance: ±10ppm; Load Capacitance: 12pF; Operating Temperature: -30°C ~ 85°C; Size / Dimension: 2.00mm x 1.60mm

## Sheet MCU1.SchDoc
size A3; SheetNumber: 6; SheetTotal: 6
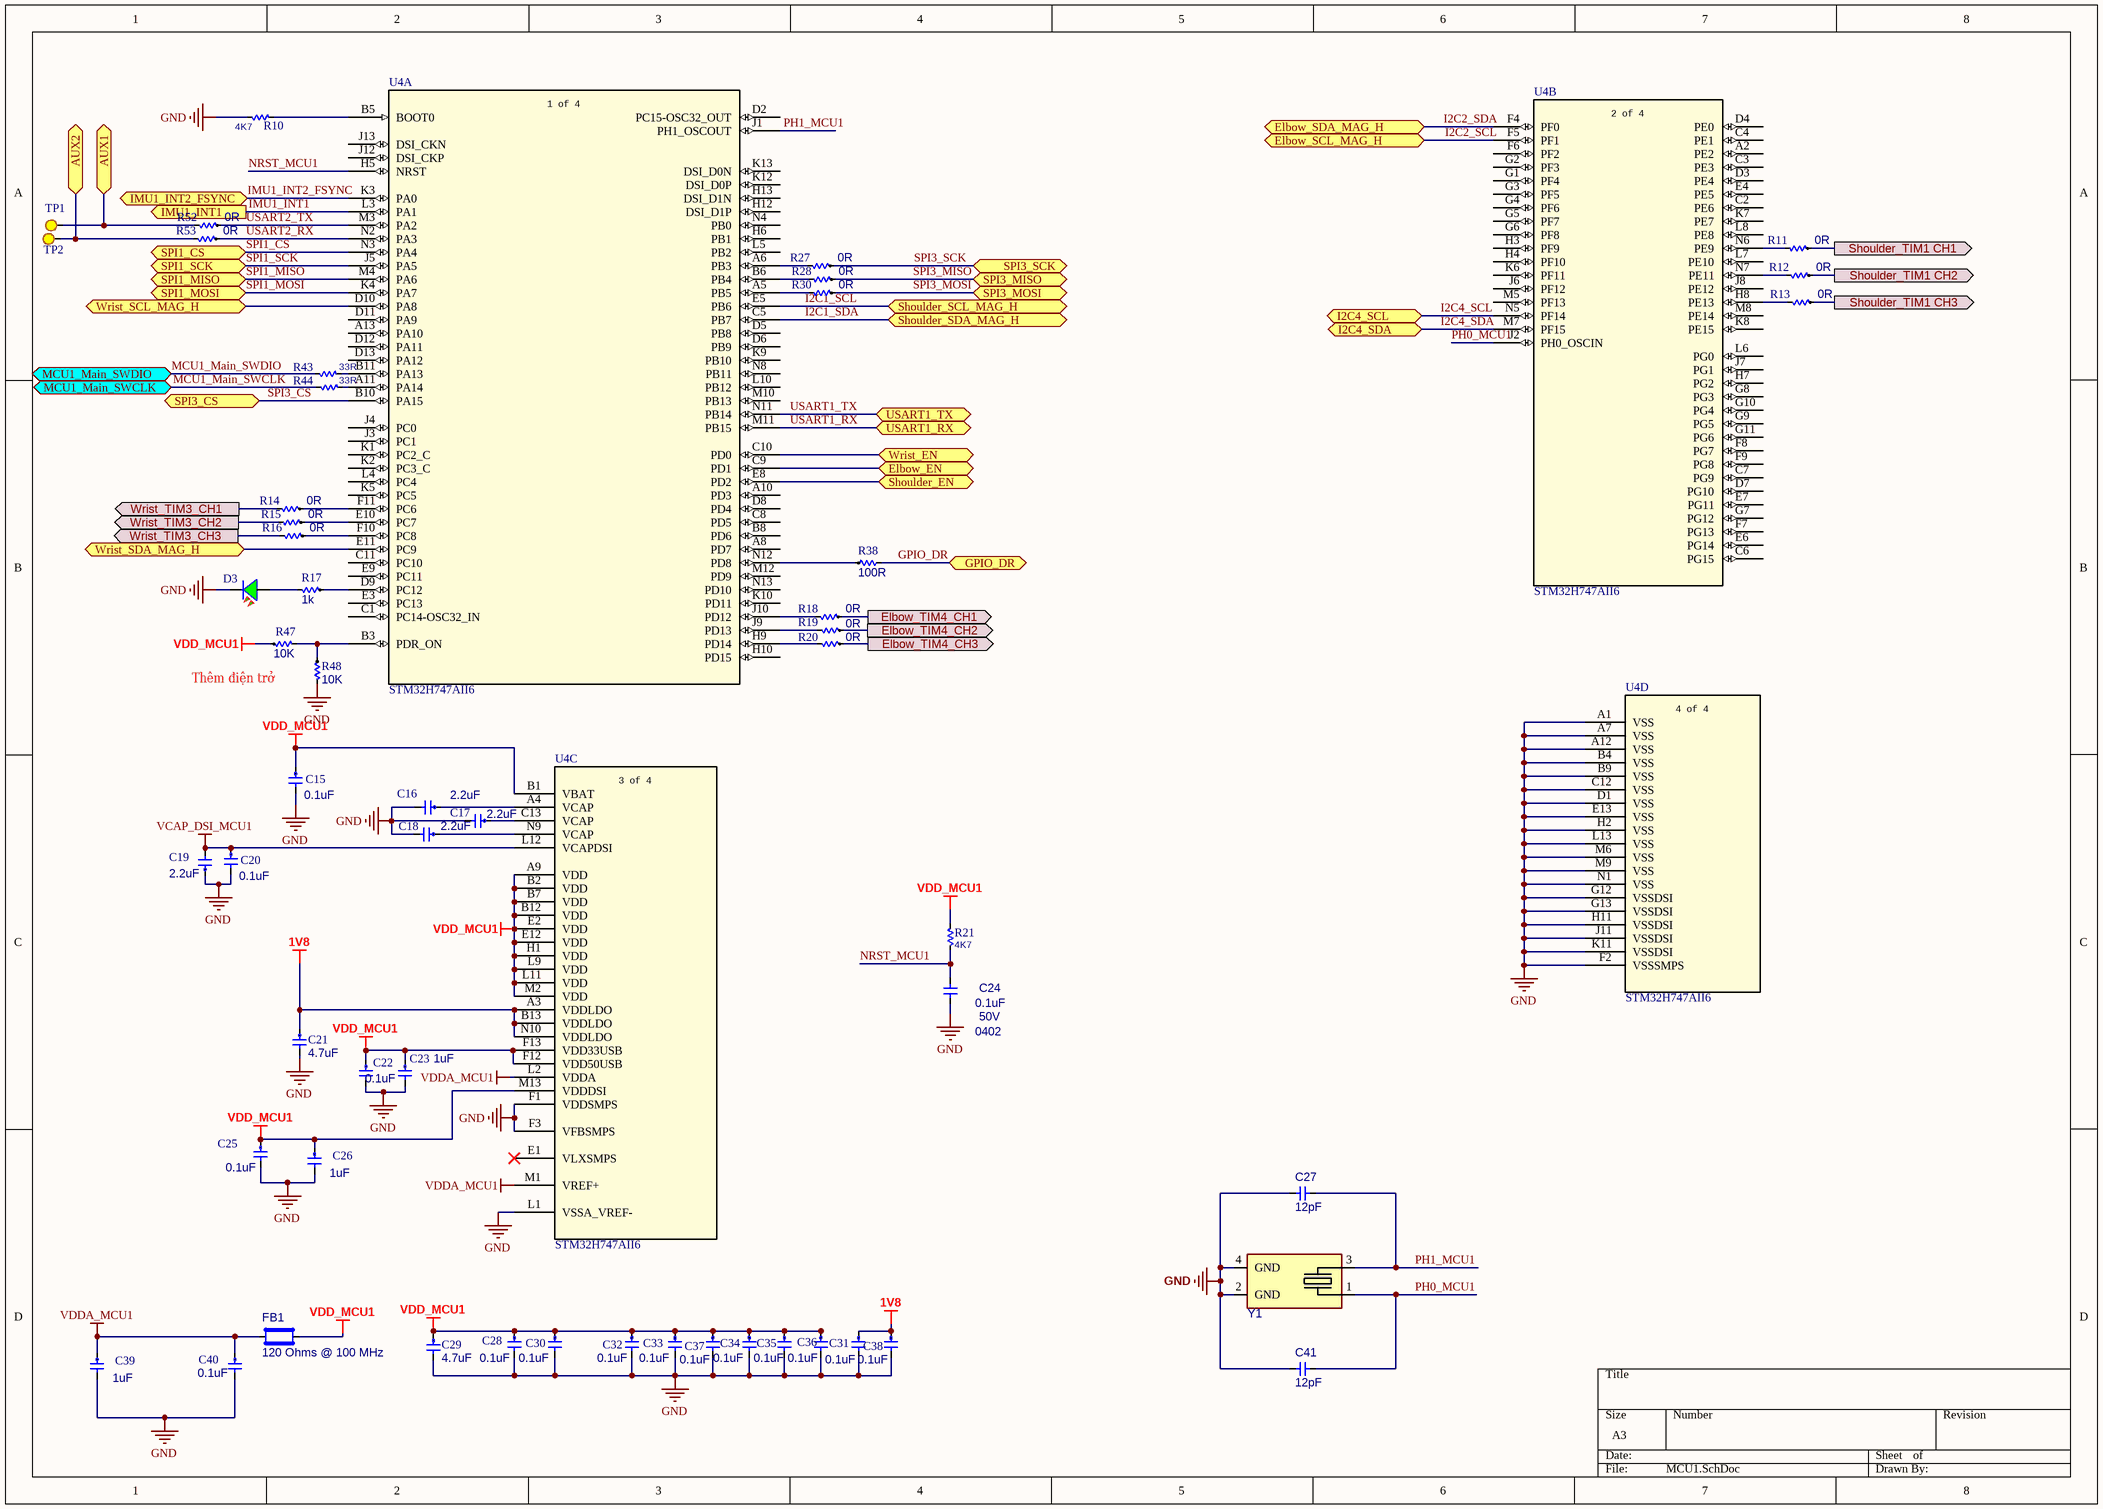
[diagram p5: MCU1.SchDoc]

### Parts
C15  value 0.1uF  [CAP0402]  (hidden comment: CAP0402 0.1uF 50V)
C16  value 2.2uF  [CAP0402]  (hidden comment: CAP0402 2.2uF 16V)
C17  value 2.2uF  [CAP0402]  (hidden comment: CAP0402 2.2uF 16V)
C18  value 2.2uF  [CAP0402]  (hidden comment: CAP0402 2.2uF 16V)
C19  value 2.2uF  [CAP0402]  (hidden comment: CAP0402 2.2uF 16V)
C20  value 0.1uF  [CAP0402]  (hidden comment: CAP0402 0.1uF 50V)
C21  value 4.7uF  [CAP0402]  (hidden comment: CAP0402 4.7uF 25V)
C22  value 1uF  [CAP0402]  (hidden comment: CAP0402 1uF 50V)
C23  value 0.1uF  [CAP0402]  (hidden comment: CAP0402 0.1uF 50V)
C24  value 0.1uF  Voltage: 50V  Package: 0402  [CAP0402]  (hidden comment: CAP0402 0.1uF 50V)
C25  value 0.1uF  [CAP0402]  (hidden comment: CAP0402 0.1uF 50V)
C26  value 1uF  [CAP0402]  (hidden comment: CAP0402 1uF 50V)
C27  value 12pF  [CAP0402]  (hidden comment: CAP0402 12pF 50V)
C28  value 0.1uF  [CAP0402]  (hidden comment: CAP0402 0.1uF 50V)
C29  value 4.7uF  [CAP0402]  (hidden comment: CAP0402 4.7uF 25V)
C30  value 0.1uF  [CAP0402]  (hidden comment: CAP0402 0.1uF 50V)
C31  value 0.1uF  [CAP0402]  (hidden comment: CAP0402 0.1uF 50V)
C32  value 0.1uF  [CAP0402]  (hidden comment: CAP0402 0.1uF 50V)
C33  value 0.1uF  [CAP0402]  (hidden comment: CAP0402 0.1uF 50V)
C34  value 0.1uF  [CAP0402]  (hidden comment: CAP0402 0.1uF 50V)
C35  value 0.1uF  [CAP0402]  (hidden comment: CAP0402 0.1uF 50V)
C36  value 0.1uF  [CAP0402]  (hidden comment: CAP0402 0.1uF 50V)
C37  value 0.1uF  [CAP0402]  (hidden comment: CAP0402 0.1uF 50V)
C38  value 0.1uF  [CAP0402]  (hidden comment: CAP0402 0.1uF 50V)
C39  value 1uF  [CAP0402]  (hidden comment: CAP0402 1uF 50V)
C40  value 0.1uF  [CAP0402]  (hidden comment: CAP0402 0.1uF 50V)
C41  value 12pF  [CAP0402]  (hidden comment: CAP0402 12pF 50V)
D3  SML-310MTT86  [LED0603 GREEN]  (value not drawn)
FB1  Impedance @ Frequency: 120 Ohms @ 100 MHz  [FERRIT0402]  (hidden comment: BLM15PX121SZ1D)
R10  value 4K7  [RES0402]  (hidden comment: RES0402 4K7)
R11  value 0R  [RES0402]  (hidden comment: RES0402 0R)
R12  value 0R  [RES0402]  (hidden comment: RES0402 0R)
R13  value 0R  [RES0402]  (hidden comment: RES0402 0R)
R14  value 0R  [RES0402]  (hidden comment: RES0402 0R)
R15  value 0R  [RES0402]  (hidden comment: RES0402 0R)
R16  value 0R  [RES0402]  (hidden comment: RES0402 0R)
R17  value 1k  [RES0402]  (hidden comment: RES0402 1K)
R18  value 0R  [RES0402]  (hidden comment: RES0402 0R)
R19  value 0R  [RES0402]  (hidden comment: RES0402 0R)
R20  value 0R  [RES0402]  (hidden comment: RES0402 0R)
R21  value 4K7  [RES0402]  (hidden comment: RES0402 4K7)
R27  value 0R  [RES0402]  (hidden comment: RES0402 0R)
R28  value 0R  [RES0402]  (hidden comment: RES0402 0R)
R30  value 0R  [RES0402]  (hidden comment: RES0402 0R)
R38  value 100R  [RES0402]  (hidden comment: RES0402 100R)
R43  value 33R  [RES0402]  (hidden comment: RES0402 33R)
R44  value 33R  [RES0402]  (hidden comment: RES0402 33R)
R47  value 10K  [RES0402]  (hidden comment: RES0402 10K)
R48  value 10K  [RES0402]  (hidden comment: RES0402 10K)
R52  value 0R  [RES0402]  (hidden comment: RES0402 0R)
R53  value 0R  [RES0402]  (hidden comment: RES0402 0R)
TP1  Test Point  [Test Point]  (value not drawn)  (no BOM)
TP2  Test Point  [Test Point]  (value not drawn)  (no BOM)
U4  STM32H747AII6  [UFBGA169]  (parts A,B,C,D of 4)
Y1  ECS-240-12-37B-CKY-TR  [XTAL_ECS-240-12-37B-CKY-TR]  (value not drawn)

### Ports
AUX1 (bidir), AUX2 (bidir), Elbow_EN (bidir), Elbow_SCL_MAG_H (bidir), Elbow_SDA_MAG_H (bidir), Elbow_TIM4_CH1 (out), Elbow_TIM4_CH2 (out), Elbow_TIM4_CH3 (out), GPIO_DR (bidir), I2C4_SCL (bidir), I2C4_SDA (bidir), IMU1_INT1 (out), IMU1_INT2_FSYNC (bidir), MCU1_Main_SWCLK (bidir), MCU1_Main_SWDIO (bidir), Shoulder_EN (bidir), Shoulder_SCL_MAG_H (bidir), Shoulder_SDA_MAG_H (bidir), Shoulder_TIM1 CH1 (out), Shoulder_TIM1 CH2 (out), Shoulder_TIM1 CH3 (out), SPI1_CS (bidir), SPI1_MISO (bidir), SPI1_MOSI (bidir), SPI1_SCK (bidir), SPI3_CS (bidir), SPI3_MISO (bidir), SPI3_MOSI (bidir), SPI3_SCK (bidir), USART1_RX (bidir), USART1_TX (bidir), Wrist_EN (bidir), Wrist_SCL_MAG_H (bidir), Wrist_SDA_MAG_H (bidir), Wrist_TIM3_CH1 (out), Wrist_TIM3_CH2 (out), Wrist_TIM3_CH3 (out)

### Nets
1V8: C21.1 C31.1 C38.1 U4.A3(VDDLDO) U4.B13(VDDLDO) U4.N10(VDDLDO)
GND: C15.2 C16.2 C17.2 C18.2 C19.1 C20.2 C21.2 C22.2 C23.2 C24.1 C25.2 C26.2 C27.2 C28.2 C29.2 C30.2 C31.2 C32.2 C33.2 C34.2 C35.2 C36.2 C37.2 C38.2 C39.2 C40.2 C41.2 D3.1 R10.1 R48.1 U4.A1(VSS) U4.A7(VSS) U4.A12(VSS) U4.B4(VSS) U4.B9(VSS) U4.C12(VSS) U4.D1(VSS) U4.E13(VSS) U4.F1(VDDSMPS) U4.F2(VSSSMPS) U4.F3(VFBSMPS) U4.G12(VSSDSI) U4.G13(VSSDSI) U4.H2(VSS) U4.H11(VSSDSI) U4.J11(VSSDSI) U4.K11(VSSDSI) U4.L1(VSSA_VREF-) U4.L13(VSS) U4.M6(VSS) U4.M9(VSS) U4.N1(VSS) Y1.2(GND) Y1.4(GND)
VCAP_DSI_MCU1: C19.2 C20.1 U4.L12(VCAPDSI)
VDD_MCU1: C15.1 C22.1 C23.1 C25.1 C26.1 C28.1 C29.1 C30.1 C32.1 C33.1 C34.1 C35.1 C36.1 C37.1 FB1.2 R21.2 R47.2 U4.A9(VDD) U4.B1(VBAT) U4.B2(VDD) U4.B7(VDD) U4.B12(VDD) U4.E2(VDD) U4.E12(VDD) U4.F12(VDD50USB) U4.F13(VDD33USB) U4.H1(VDD) U4.L9(VDD) U4.L11(VDD) U4.M2(VDD) U4.M13(VDDDSI)
VDDA_MCU1: C39.1 C40.1 FB1.1 U4.L2(VDDA) U4.M1(VREF+)
AUX1: R52.1 TP1.TP(Test_Point) ; port AUX1
AUX2: R53.1 TP2.TP(Test_Point) ; port AUX2
Elbow_TIM4_CH1: R18.2 ; port Elbow_TIM4_CH1
Elbow_TIM4_CH2: R19.2 ; port Elbow_TIM4_CH2
Elbow_TIM4_CH3: R20.2 ; port Elbow_TIM4_CH3
GPIO_DR: R38.1 ; port GPIO_DR
I2C1_SCL: U4.E5(PB6) ; port Shoulder_SCL_MAG_H
I2C1_SDA: U4.C5(PB7) ; port Shoulder_SDA_MAG_H
I2C2_SCL: U4.F5(PF1) ; port Elbow_SCL_MAG_H  [project net Elbow_SCL_MAG_H]
I2C2_SDA: U4.F4(PF0) ; port Elbow_SDA_MAG_H  [project net Elbow_SDA_MAG_H]
I2C4_SCL: U4.N5(PF14) ; port I2C4_SCL
I2C4_SDA: U4.M7(PF15) ; port I2C4_SDA
IMU1_INT1: U4.L3(PA1) ; port IMU1_INT1
IMU1_INT2_FSYNC: U4.K3(PA0) ; port IMU1_INT2_FSYNC
MCU1_Main_SWCLK: R44.1 ; port MCU1_Main_SWCLK
MCU1_Main_SWDIO: R43.1 ; port MCU1_Main_SWDIO
NRST_MCU1: C24.2 R21.1 U4.H5(NRST)
PH0_MCU1: C41.1 U4.J2(PH0_OSCIN) Y1.1(IO)
PH1_MCU1: C27.1 U4.J1(PH1_OSCOUT) Y1.3(IO)
Shoulder_TIM1 CH1: R11.2 ; port Shoulder_TIM1 CH1
Shoulder_TIM1 CH2: R12.2 ; port Shoulder_TIM1 CH2
Shoulder_TIM1 CH3: R13.2 ; port Shoulder_TIM1 CH3
SPI1_CS: U4.N3(PA4) ; port SPI1_CS
SPI1_MISO: U4.M4(PA6) ; port SPI1_MISO
SPI1_MOSI: U4.K4(PA7) ; port SPI1_MOSI
SPI1_SCK: U4.J5(PA5) ; port SPI1_SCK
SPI3_CS: U4.B10(PA15) ; port SPI3_CS
SPI3_MISO: R28.2 ; port SPI3_MISO
SPI3_MOSI: R30.2 ; port SPI3_MOSI
SPI3_SCK: R27.2 ; port SPI3_SCK
USART1_RX: U4.M11(PB15) ; port USART1_RX
USART1_TX: U4.N11(PB14) ; port USART1_TX
USART2_RX: R53.2 U4.N2(PA3)
USART2_TX: R52.2 U4.M3(PA2)
Wrist_SCL_MAG_H: U4.D10(PA8) ; port Wrist_SCL_MAG_H
Wrist_SDA_MAG_H: U4.E11(PC9) ; port Wrist_SDA_MAG_H
Wrist_TIM3_CH1: R14.1 ; port Wrist_TIM3_CH1
Wrist_TIM3_CH2: R15.1 ; port Wrist_TIM3_CH2
Wrist_TIM3_CH3: R16.1 ; port Wrist_TIM3_CH3
NetC16_1: C16.1 U4.A4(VCAP)
NetC17_1: C17.1 U4.C13(VCAP)
NetC18_1: C18.1 U4.N9(VCAP)
NetD3_2: D3.2 R17.1
NetP1_12: U4.C10(PD0) ; port Wrist_EN
NetP1_14: U4.C9(PD1) ; port Elbow_EN
NetP1_16: U4.E8(PD2) ; port Shoulder_EN
NetR10_2: R10.2 U4.B5(BOOT0)
NetR11_1: R11.1 U4.N6(PE9)
NetR12_1: R12.1 U4.N7(PE11)
NetR13_1: R13.1 U4.H8(PE13)
NetR14_2: R14.2 U4.F11(PC6)
NetR15_2: R15.2 U4.E10(PC7)
NetR16_2: R16.2 U4.F10(PC8)
NetR17_2: R17.2 U4.D9(PC12)
NetR18_1: R18.1 U4.J10(PD12)
NetR19_1: R19.1 U4.J9(PD13)
NetR20_1: R20.1 U4.H9(PD14)
NetR27_1: R27.1 U4.A6(PB3)
NetR28_1: R28.1 U4.B6(PB4)
NetR30_1: R30.1 U4.A5(PB5)
NetR38_2: R38.2 U4.N12(PD8)
NetR43_2: R43.2 U4.B11(PA13)
NetR44_2: R44.2 U4.A11(PA14)
NetR47_1: R47.1 R48.2 U4.B3(PDR_ON)

Not connected (* = marked no-connect by the designer): U4 A2(PE2) A8(PD7) A10(PD3) A13(PA10) B8(PD6) C1(PC14-OSC32_IN) C2(PE6) C3(PE3) C4(PE1) C6(PG15) C7(PG9) C8(PD5) C11(PC10) D2(PC15-OSC32_OUT) D3(PE4) D4(PE0) D5(PB8) D6(PB9) D7(PG10) D8(PD4) D11(PA9) D12(PA11) D13(PA12) E1(VLXSMPS)* E3(PC13) E4(PE5) E6(PG14) E7(PG11) E9(PC11) F6(PF2) F7(PG13) F8(PG7) F9(PG8) G1(PF4) G2(PF3) G3(PF5) G4(PF6) G5(PF7) G6(PF8) G7(PG12) G8(PG3) G9(PG5) G10(PG4) G11(PG6) H3(PF9) H4(PF10) H6(PB1) H7(PG2) H10(PD15) H12(DSI_D1P) H13(DSI_D1N) J3(PC1) J4(PC0) J6(PF12) J7(PG1) J8(PE12) J12(DSI_CKP) J13(DSI_CKN) K1(PC2_C) K2(PC3_C) K5(PC5) K6(PF11) K7(PE7) K8(PE15) K9(PB10) K10(PD11) K12(DSI_D0P) K13(DSI_D0N) L4(PC4) L5(PB2) L6(PG0) L7(PE10) L8(PE8) L10(PB12) M5(PF13) M8(PE14) M10(PB13) M12(PD9) N4(PB0) N8(PB11) N13(PD10)

### Notes on the sheet
- Thêm điện trở
- (in symbol STM32H747AII6, part A) 1 of 4
- (in symbol STM32H747AII6, part B) 2 of 4
- (in symbol STM32H747AII6, part C) 3 of 4
- (in symbol STM32H747AII6, part D) 4 of 4

### Library data of the parts
C15 C20 C23 C25 C28 C30-C38 C40 = CAP0402 0.1uF 50V: as C69 on sheet IMU; Voltage: 50V; Package: 0402
C16-C19 = CAP0402 2.2uF 16V: as C43 on sheet MCU2; Voltage: 16V; Package: 0402
C21 C29 = CAP0402 4.7uF 25V: as C48 on sheet MCU2; Voltage: 25V; Package: 0402
C22 C26 C39 = CAP0402 1uF 50V: Cap 1uF 50V 0402; MP: GRM155R61H105KE05D; Voltage - Rate: 50V; Package: 0402
C24 = CAP0402 0.1uF 50V: as C51 on sheet MCU2
C27 C41 = CAP0402 12pF 50V: Cap 12pF 50V 0402
D3 = CMP-01130-2: as D1 on sheet PWR; Case Code (Imperial): 0603; Lens Transparency: Clear; Package Quantity: 3000; Width: 0.8mm; Manufacturer Part Number 1: SML-310MTT86; Min Operating Temperature: -30°C; Length: 1.6mm; Packaging: Tape and Reel; Dominant Wavelength: 570nm; Height: 0.9mm; Radiation Hardening: No; Test Current: 20mA; Case Code (Metric): 1608; Lead Free: Lead Free; Case/Package: 0603; Mount: Surface Mount; Max Operating Temperature: 85°C; Illumination Color: Green; Number of Pins: 2
FB1 = BLM15PX121SZ1D: as FB3 on sheet PWR; MP: BLM15PX121SZ1D; Current Rating (Max): 2A; DC Resistance (DCR) (Max): 55mOhm
R10 R21 = RES0402 4K7: RES 4K7 0402; MP: RC0402JR-074K7L
R11-R16 R18-R20 R27 R28 R30 R52 R53 = RES0402 0R: as R25 on sheet Connector; Package: 0402
R17 = RES0402 1K: as R29 on sheet MCU2; Package: 0402
R38 = RES0402 100R: RES 100R 0402; MP: RC0402FR-07100RL
R43 R44 = RES0402 33R: RES 33R 0402; MP: RC0402FR-0733RL
R47 R48 = RES0402 10K: as R39 on sheet MCU2; Package: 0402
U4 = STM32H747AII6: as U5 on sheet MCU2; Copyright: Copyright (C) 2026 Ultra Librarian. All rights reserved.; Manufacturer_Part_Number: STM32H747AII6; RefDes: RefDes; Type: Type
Y1 = ECS-240-12-37B-CKY-TR: as Y2 on sheet MCU2; MP: ECS-240-12-37B-CKY-TR; Frequency Stability: ±10ppm; Frequency Tolerance: ±10ppm; Load Capacitance: 12pF; Operating Temperature: -30°C ~ 85°C; Size / Dimension: 2.00mm x 1.60mm

## Nets that join several sheets
1V8: PWR (6 pins), MCU2 (6 pins), MCU1 (6 pins)
GND: Connector (16 pins), IMU (9 pins), PWR (28 pins), RS232 (5 pins), MCU2 (55 pins), MCU1 (54 pins)
VDD_MCU1: IMU (5 pins), PWR (FB3.2 R7.2), RS232 (C72.1 U7.14), MCU1 (31 pins)
VDD_MCU2: PWR (FB4.2 R8.2), MCU2 (32 pins)
AUX1: Connector (P1.27 R25.1), MCU1 (R52.1 TP1.TP)
AUX2: Connector (P1.29 R26.1), MCU1 (R53.1 TP2.TP)
Elbow_SCL_IMU1_H: Connector (P1.51), MCU2 (U5.F5)
Elbow_SCL_MAG_H: Connector (P1.47), MCU1 (U4.F5)
Elbow_SDA_IMU1_H: Connector (P1.49), MCU2 (U5.F4)
Elbow_SDA_MAG_H: Connector (P1.45), MCU1 (U4.F4)
Elbow_TIM4_CH1: Connector (P1.28), MCU1 (R18.2)
Elbow_TIM4_CH2: Connector (P1.30), MCU1 (R19.2)
Elbow_TIM4_CH3: Connector (P1.32), MCU1 (R20.2)
GPIO_DR: MCU2 (R39.1 R40.2 U5.N2), MCU1 (R38.1)
I2C1_SCL: Connector (P1.35), MCU1 (U4.E5)
I2C1_SDA: Connector (P1.37), MCU1 (U4.C5)
I2C3_SCL: Connector (P1.50), MCU2 (U5.D10)
I2C3_SDA: Connector (P1.52), MCU2 (U5.E11)
I2C4_SCL: MCU2 (U5.N5), MCU1 (U4.N5)
I2C4_SDA: MCU2 (U5.M7), MCU1 (U4.M7)
IMU1_INT1: IMU (R24.2), MCU1 (U4.L3)
IMU1_INT2_FSYNC: IMU (R23.1), MCU1 (U4.K3)
MCU1_Main_SWCLK: Connector (P1.4), MCU1 (R44.1)
MCU1_Main_SWDIO: Connector (P1.2), MCU1 (R43.1)
MCU2_Main_SWCLK: Connector (P1.8), MCU2 (R32.1)
MCU2_Main_SWDIO: Connector (P1.6), MCU2 (R31.1)
NetP1_12: Connector (P1.12), MCU1 (U4.C10)
NetP1_14: Connector (P1.14), MCU1 (U4.C9)
NetP1_16: Connector (P1.16), MCU1 (U4.E8)
RS232_GB_RX: Connector (P1.13), RS232 (U7.11)
RS232_GB_TX: Connector (P1.11), RS232 (U7.12)
RS232_RX: Connector (P1.23), RS232 (U7.6)
RS232_TX: Connector (P1.21), RS232 (U7.5)
RXD0: Connector (P2.13), RS232 (R35.1)
Shoulder_SCL_IMU1_H: Connector (P1.39), MCU2 (U5.E5)
Shoulder_SDA_IMU1_H: Connector (P1.41), MCU2 (U5.C5)
Shoulder_TIM1 CH1: Connector (P1.20), MCU1 (R11.2)
Shoulder_TIM1 CH2: Connector (P1.22), MCU1 (R12.2)
Shoulder_TIM1 CH3: Connector (P1.24), MCU1 (R13.2)
SPI1_CS: IMU (U6.12), MCU1 (U4.N3)
SPI1_MISO: IMU (U6.1), MCU1 (U4.M4)
SPI1_MOSI: IMU (U6.14), MCU1 (U4.K4)
SPI1_SCK: IMU (U6.13), MCU1 (U4.J5)
SPI3_CS: MCU2 (U5.B10), MCU1 (U4.B10)
SPI3_MISO: MCU2 (U5.B6), MCU1 (R28.2)
SPI3_MOSI: MCU2 (U5.A5), MCU1 (R30.2)
SPI3_SCK: MCU2 (U5.A6), MCU1 (R27.2)
TXD0: Connector (P2.11), RS232 (R34.1)
USART1_RX: RS232 (R37.1), MCU1 (U4.M11)
USART1_TX: RS232 (R36.1), MCU1 (U4.N11)
Wrist_SCL_MAG_H: Connector (P1.44), MCU1 (U4.D10)
Wrist_SDA_MAG_H: Connector (P1.46), MCU1 (U4.E11)
Wrist_TIM3_CH1: Connector (P1.36), MCU1 (R14.1)
Wrist_TIM3_CH2: Connector (P1.38), MCU1 (R15.1)
Wrist_TIM3_CH3: Connector (P1.40), MCU1 (R16.1)